# Altium project C40 IMB Upgrade.PrjPCB
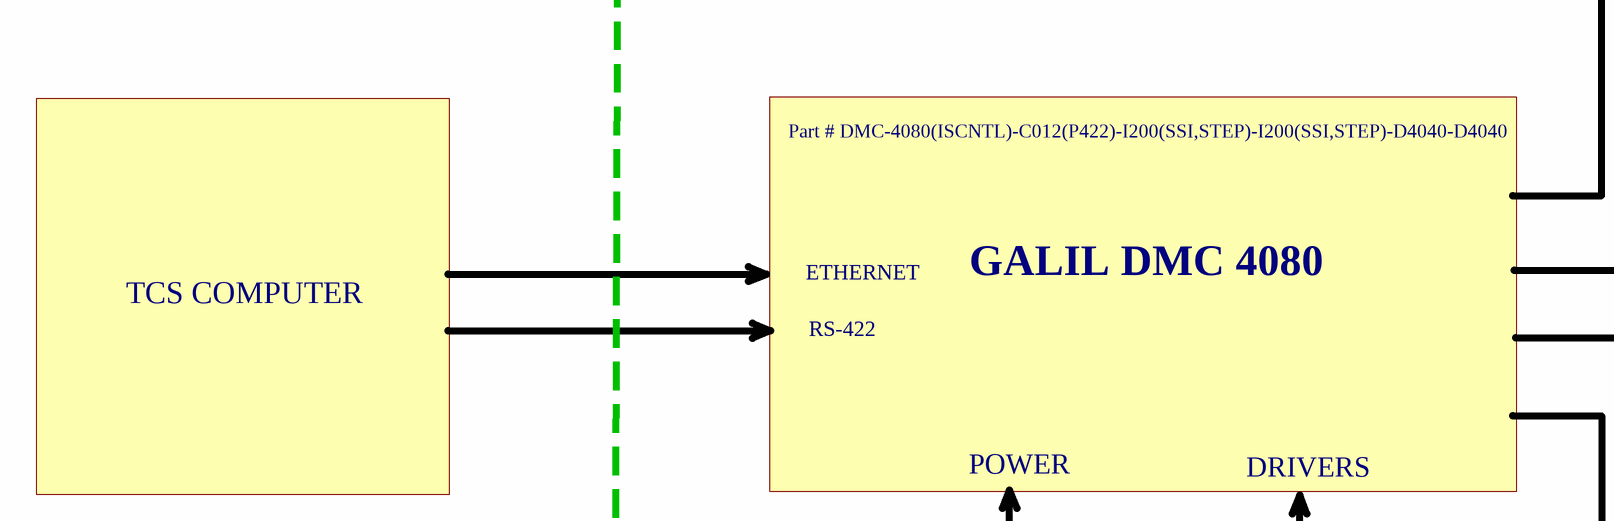
[diagram p0: C40_IMB_Block_Diagram.SchDoc, top left]
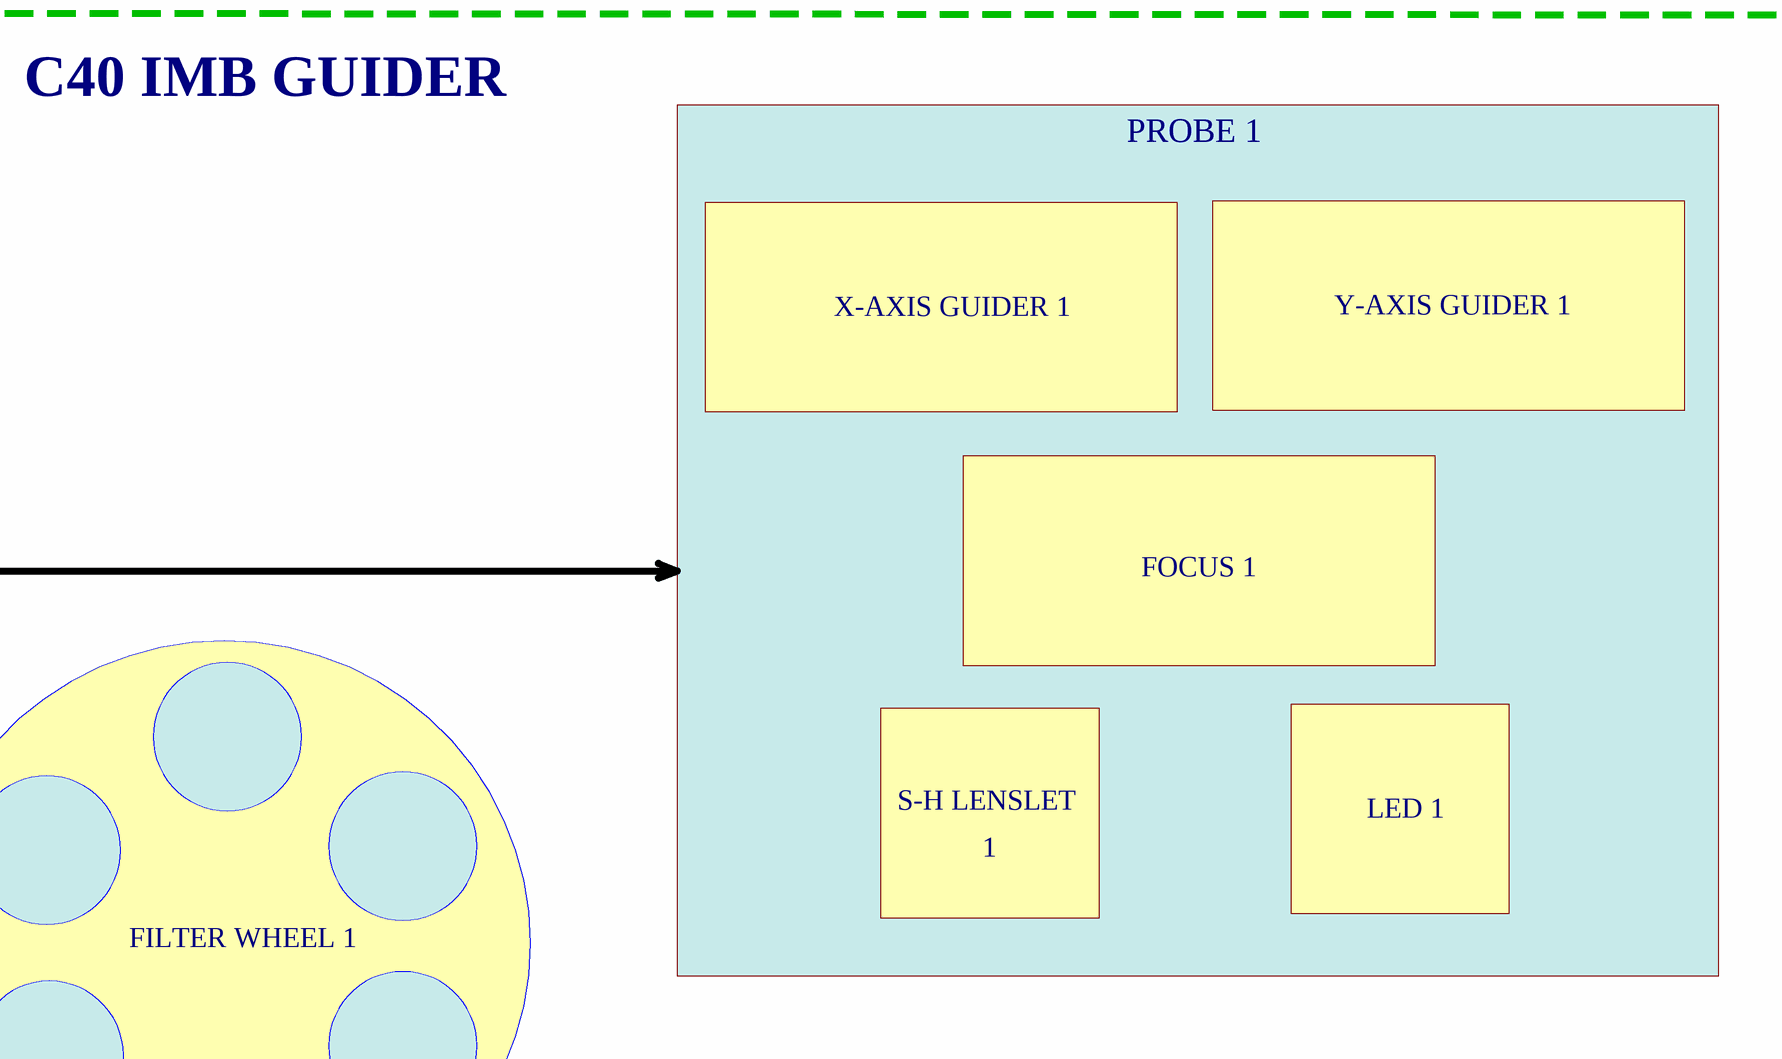
[diagram p1: C40_IMB_Block_Diagram.SchDoc, top right]
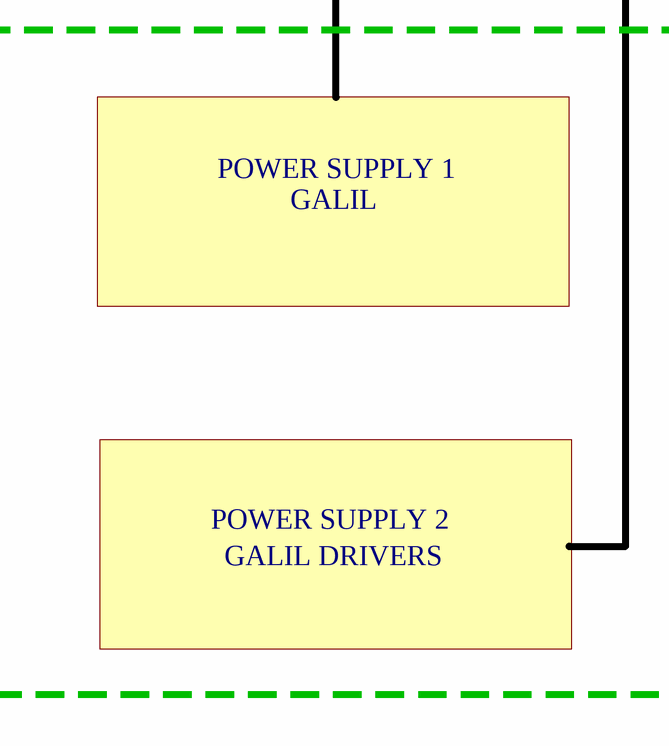
[diagram p2: C40_IMB_Block_Diagram.SchDoc, bottom left]
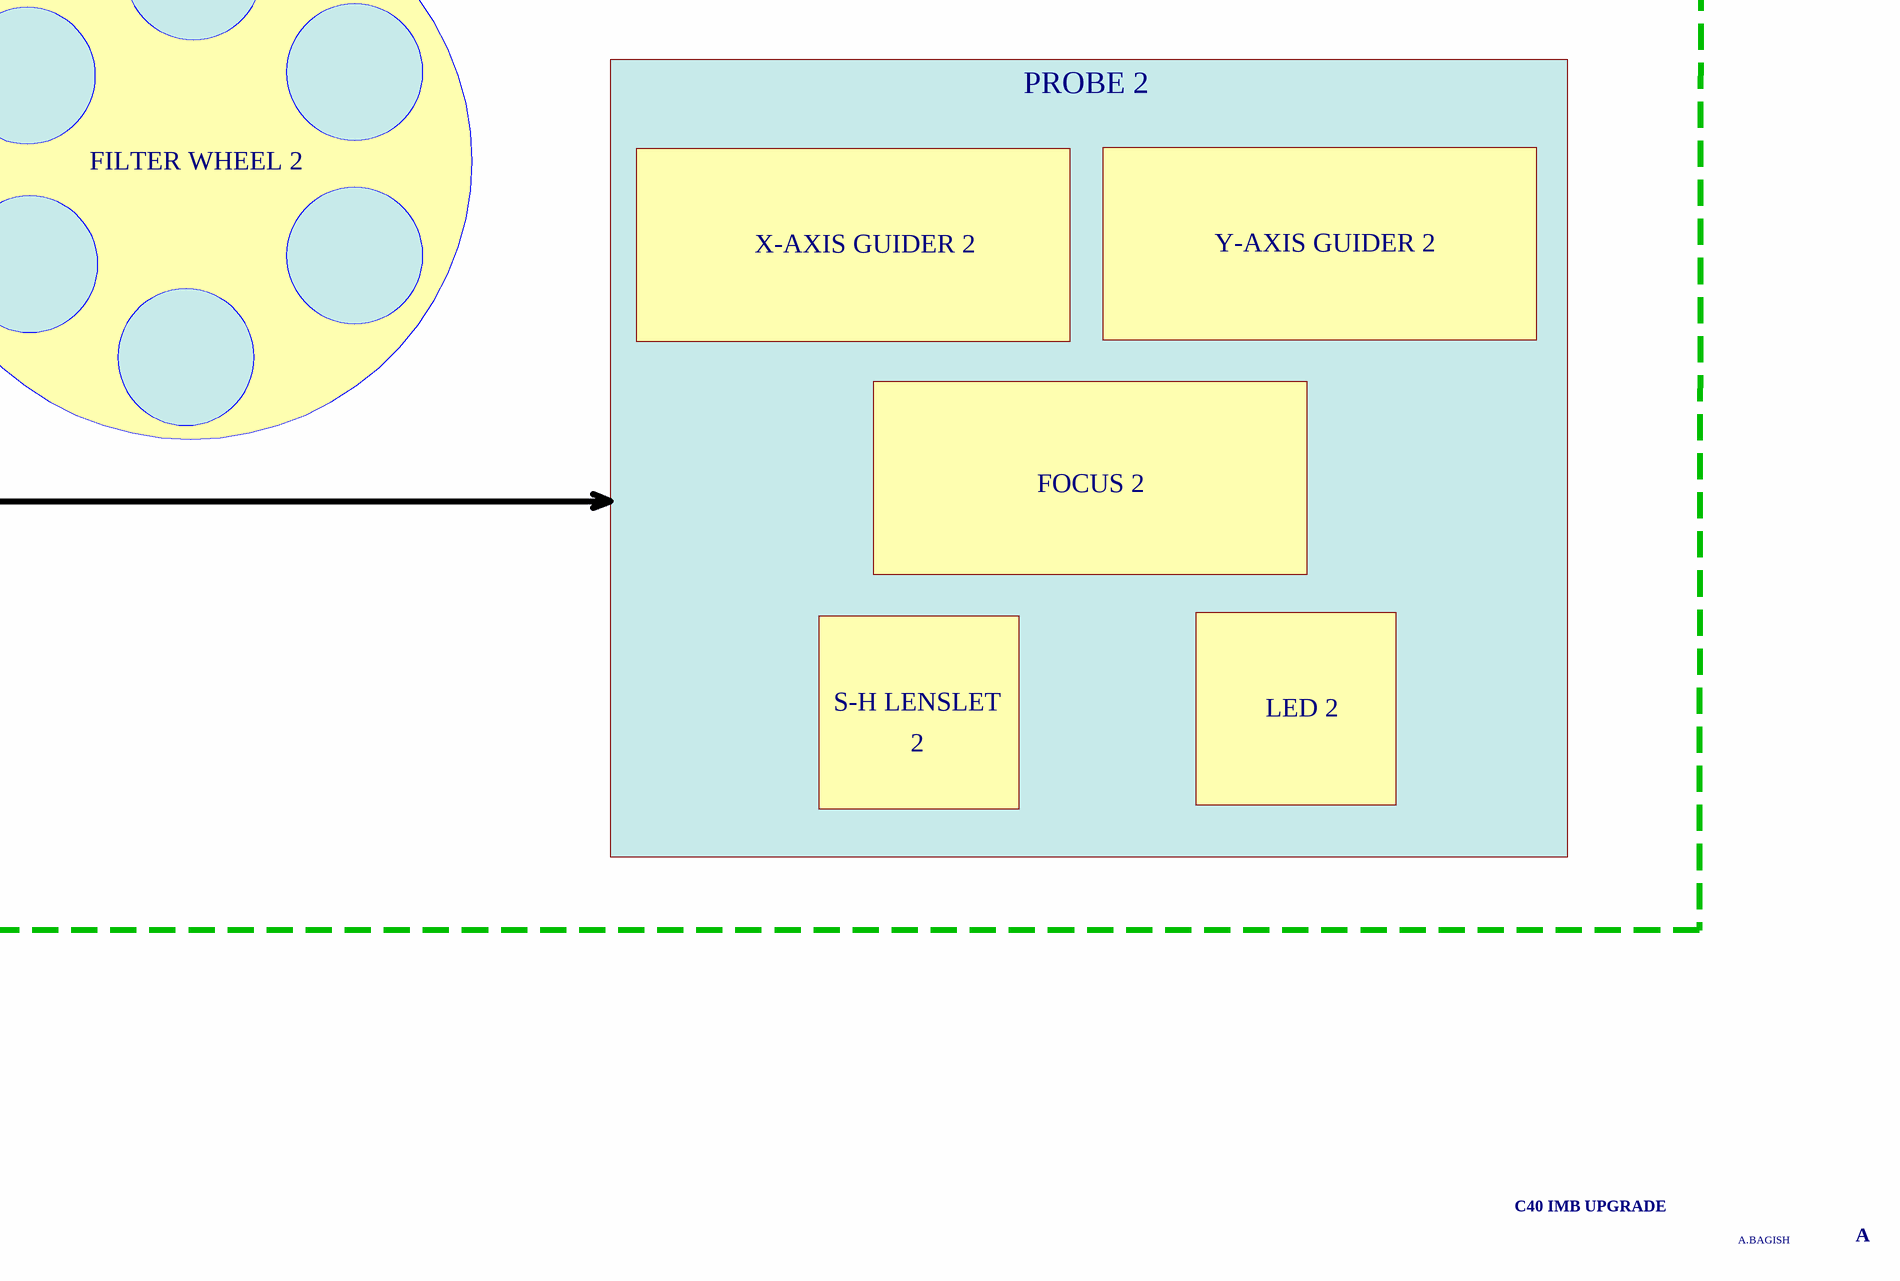
[diagram p3: C40_IMB_Block_Diagram.SchDoc, bottom right]
6 sheets, 221 parts. Net scope: flat (ports and power ports of the same name join across sheets).
Sheets:
  C40_IMB_Block_Diagram.SchDoc
  C40_IMB_Block_Diagram_2.SchDoc
  PROBE 1 CYLINDERS.SchDoc
  PROBE 2 CYLINDERS.SchDoc
  MOTORS ENCODERS.SchDoc
  C40 IMB POWER SUPPLY.SchDoc

## Sheet C40_IMB_Block_Diagram.SchDoc
size 812 x 571 mm; DocumentNumber: 2; SheetNumber: 1; SheetTotal: 7; PageSetup: Record=PageOptions|CenterHorizontal=True|CenterVertical=True|PrintScale=0.34|XCorrection=1.00|YCorrection=1.00|PrintKind=0|BorderSize=5000000|LeftOffset=0|BottomOffset=0|Orientation=2|PaperLength=1000|PaperWidth=1000|Scale=100|PaperSource=259|PrintQuality=600|MediaType=1|DitherType=10|PaperKind=11 x 17|PrintScaleMode=1

### Notes on the sheet
- C40 IMB GUIDER
- PROBE 1
- X-AXIS GUIDER 1
- Y-AXIS GUIDER 1
- FOCUS 1
- S-H LENSLET
- 1
- LED 1
- FILTER WHEEL 1
- Part # DMC-4080(ISCNTL)-C012(P422)-I200(SSI,STEP)-I200(SSI,STEP)-D4040-D4040
- TCS COMPUTER
- ETHERNET
- GALIL DMC 4080
- RS-422
- POWER
- DRIVERS
- PROBE 2
- FILTER WHEEL 2
- X-AXIS GUIDER 2
- Y-AXIS GUIDER 2
- POWER SUPPLY 1
- GALIL
- FOCUS 2
- LED 2
- POWER SUPPLY 2
- 2
- GALIL DRIVERS
- C40 IMB UPGRADE
- A.BAGISH
- A
- Carnegie Institution of Washington
- Pasadena, California 91101
- 813 Santa Barbara Street
- The Observatories
- PHONE (626) 577-1122               FAX (626) 795-8136
- Title:
- OCIW
- Size:
- Date:
- File:
- D
- Scale:
- Drawn By:
- Checked By:
- A. BAGISH
- alanb
- Revision:
- Sheet          of

## Sheet C40_IMB_Block_Diagram_2.SchDoc: C40 IMB BLOCK DIAGRAM 2
size 812 x 571 mm; DocumentNumber: 3; SheetNumber: 2; SheetTotal: 7; PageSetup: Record=PageOptions|CenterHorizontal=True|CenterVertical=True|PrintScale=0.48|XCorrection=1.00|YCorrection=1.00|PrintKind=0|BorderSize=5000000|LeftOffset=0|BottomOffset=0|Orientation=2|PaperLength=1000|PaperWidth=1000|Scale=100|PaperSource=15|PrintQuality=1200|MediaType=1|DitherType=10|PaperKind=11 x 17|PrintScaleMode=1
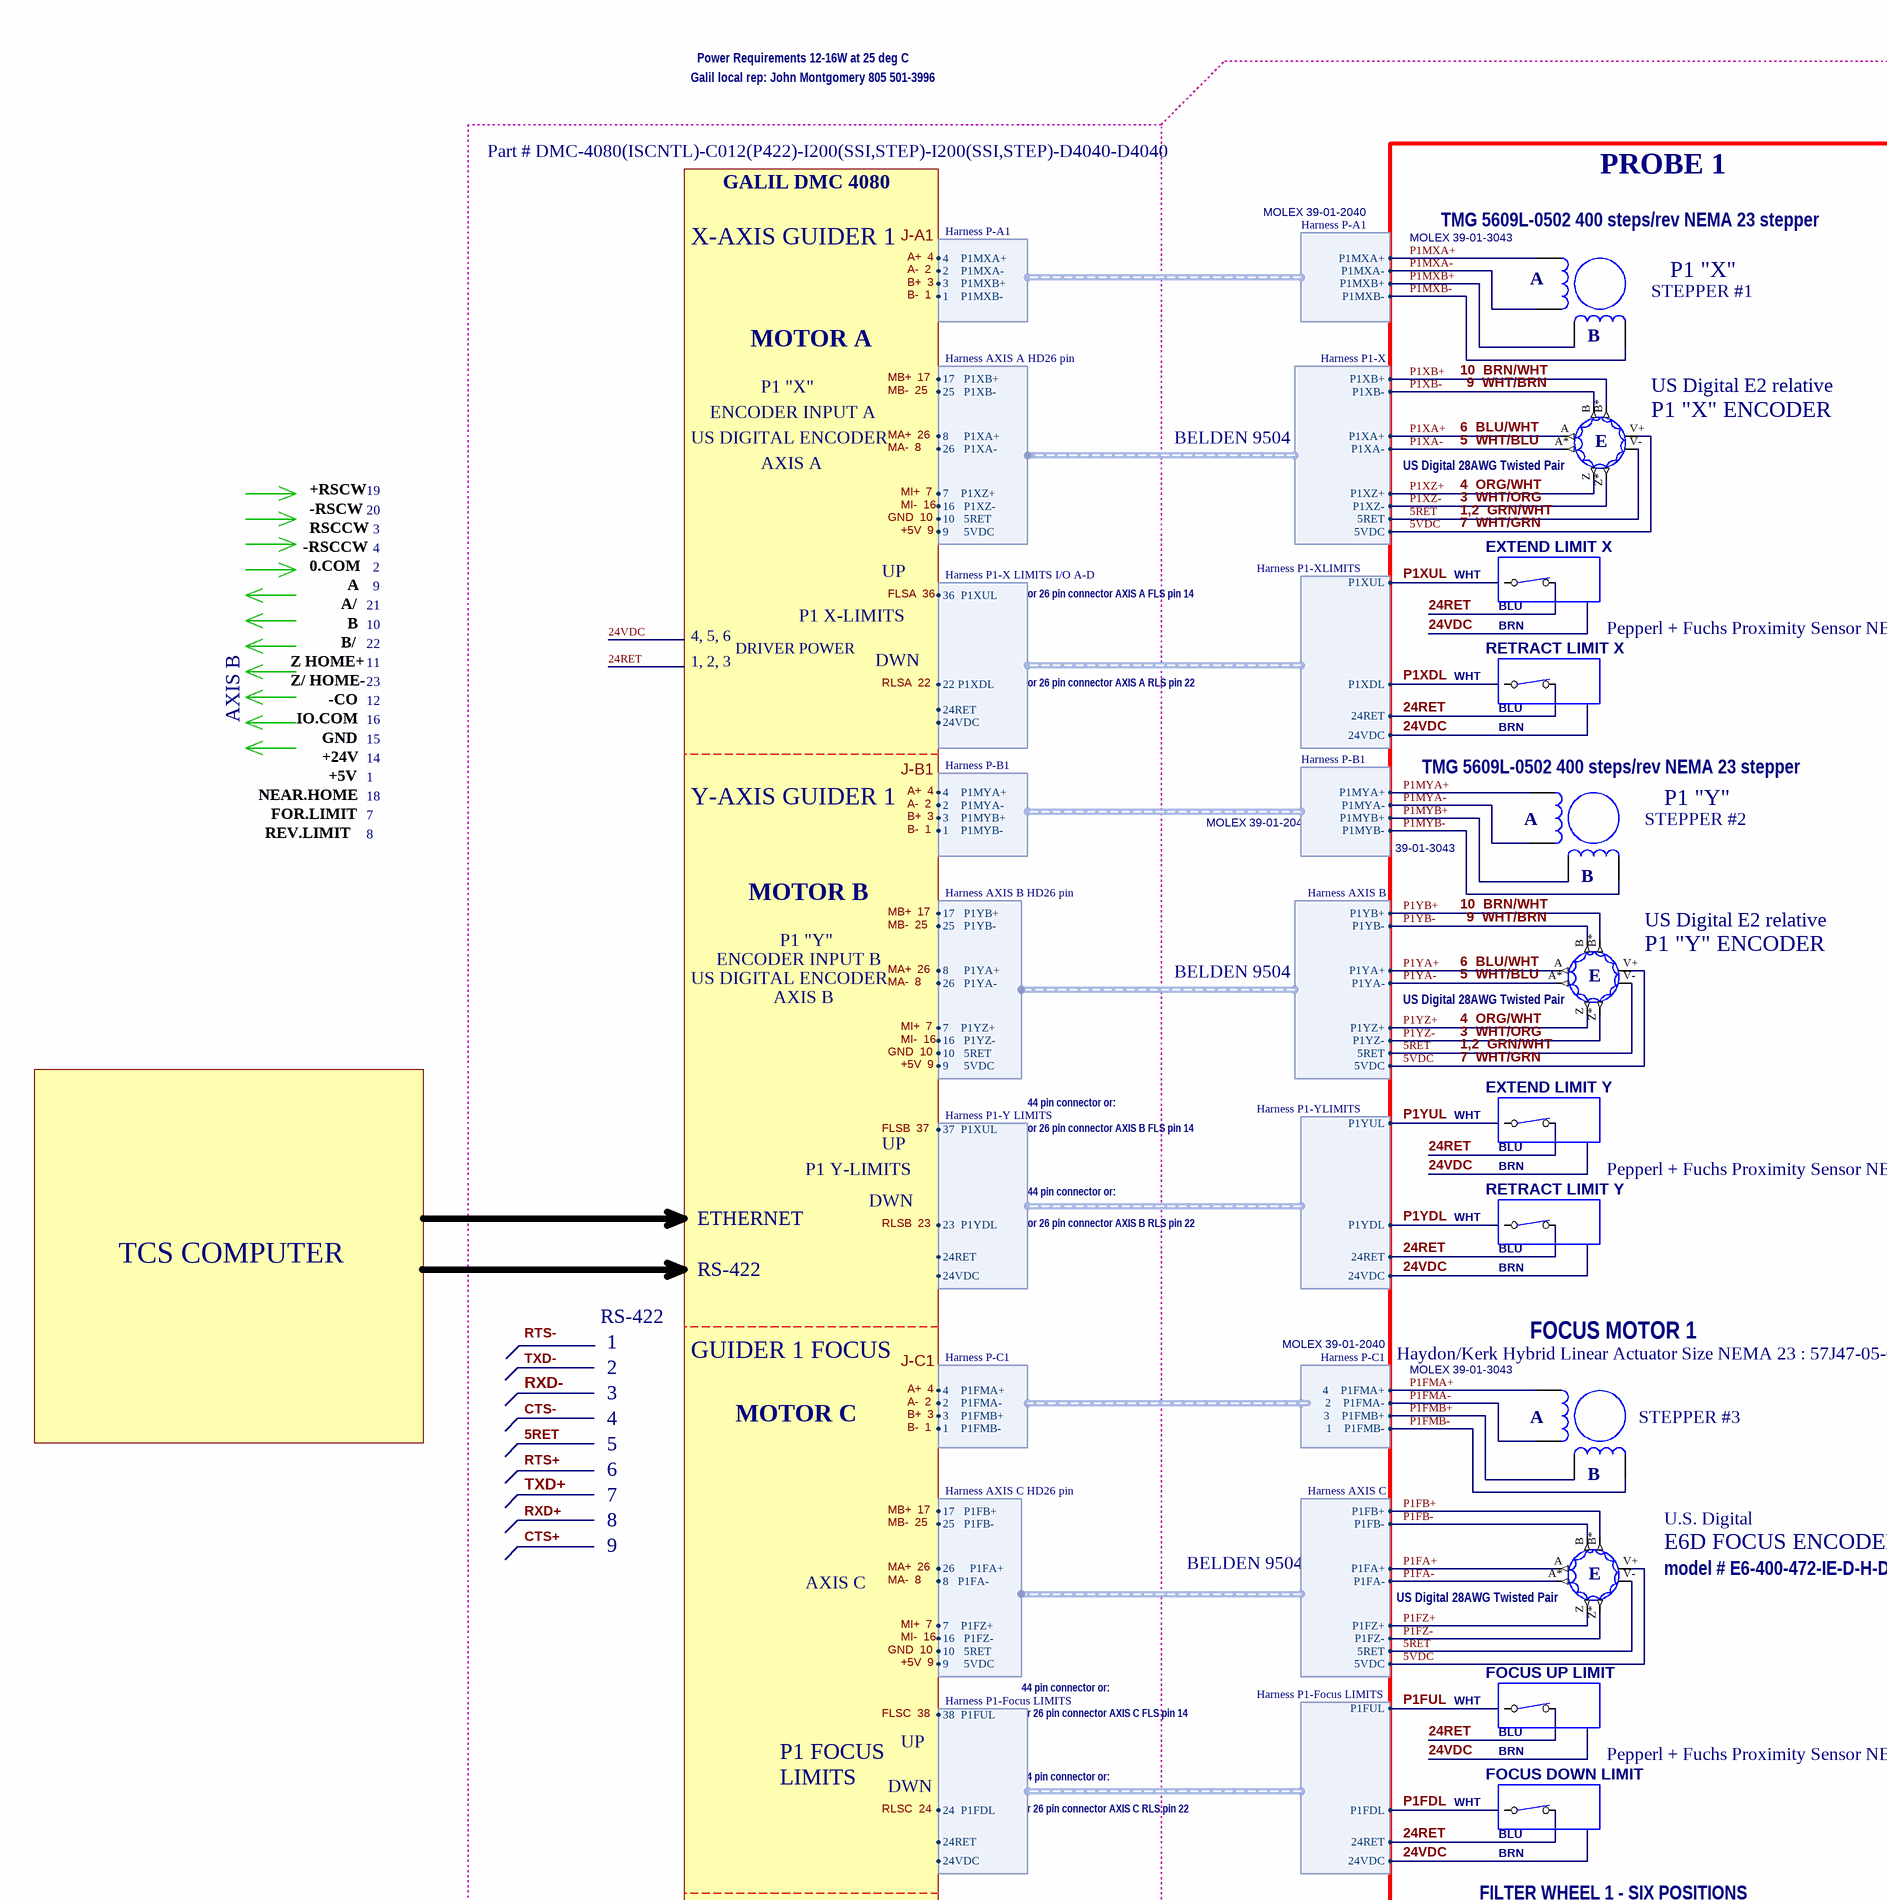
[diagram p4: C40_IMB_Block_Diagram_2.SchDoc, top left]
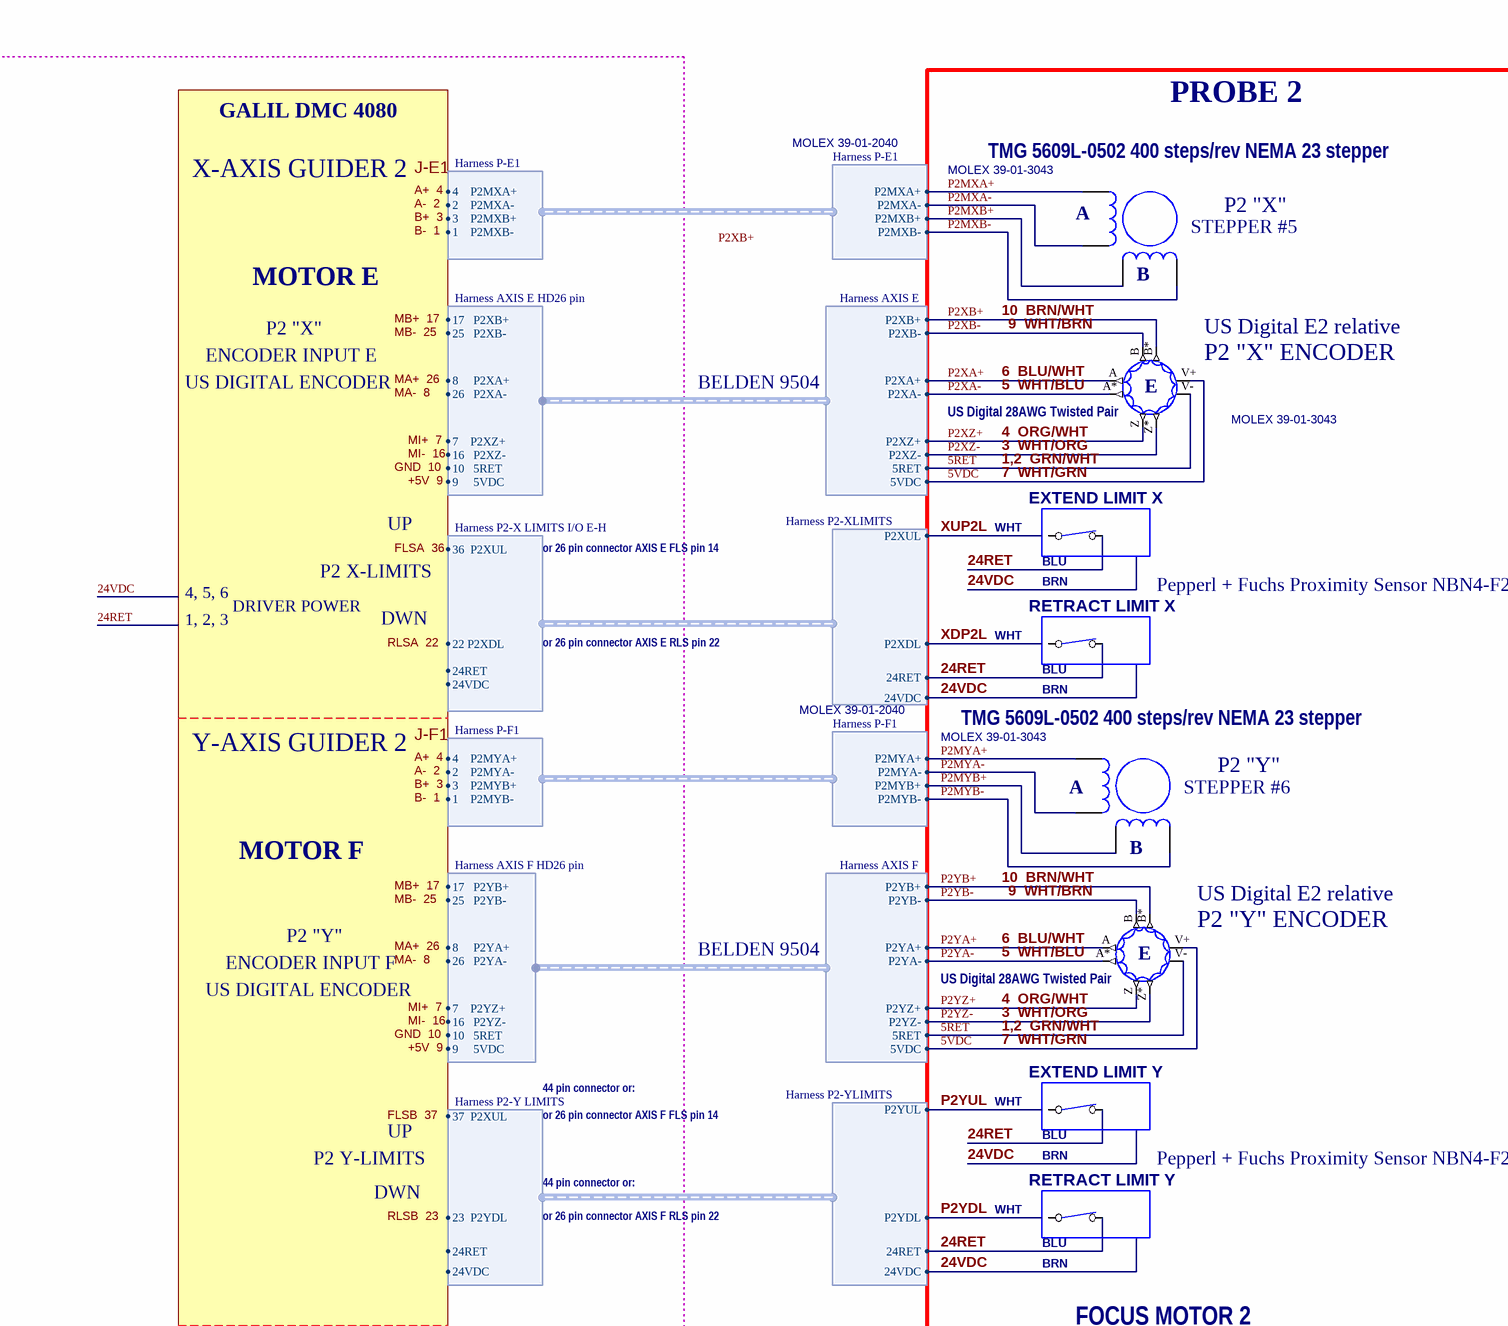
[diagram p5: C40_IMB_Block_Diagram_2.SchDoc, top middle]
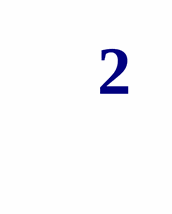
[diagram p6: C40_IMB_Block_Diagram_2.SchDoc, top right]
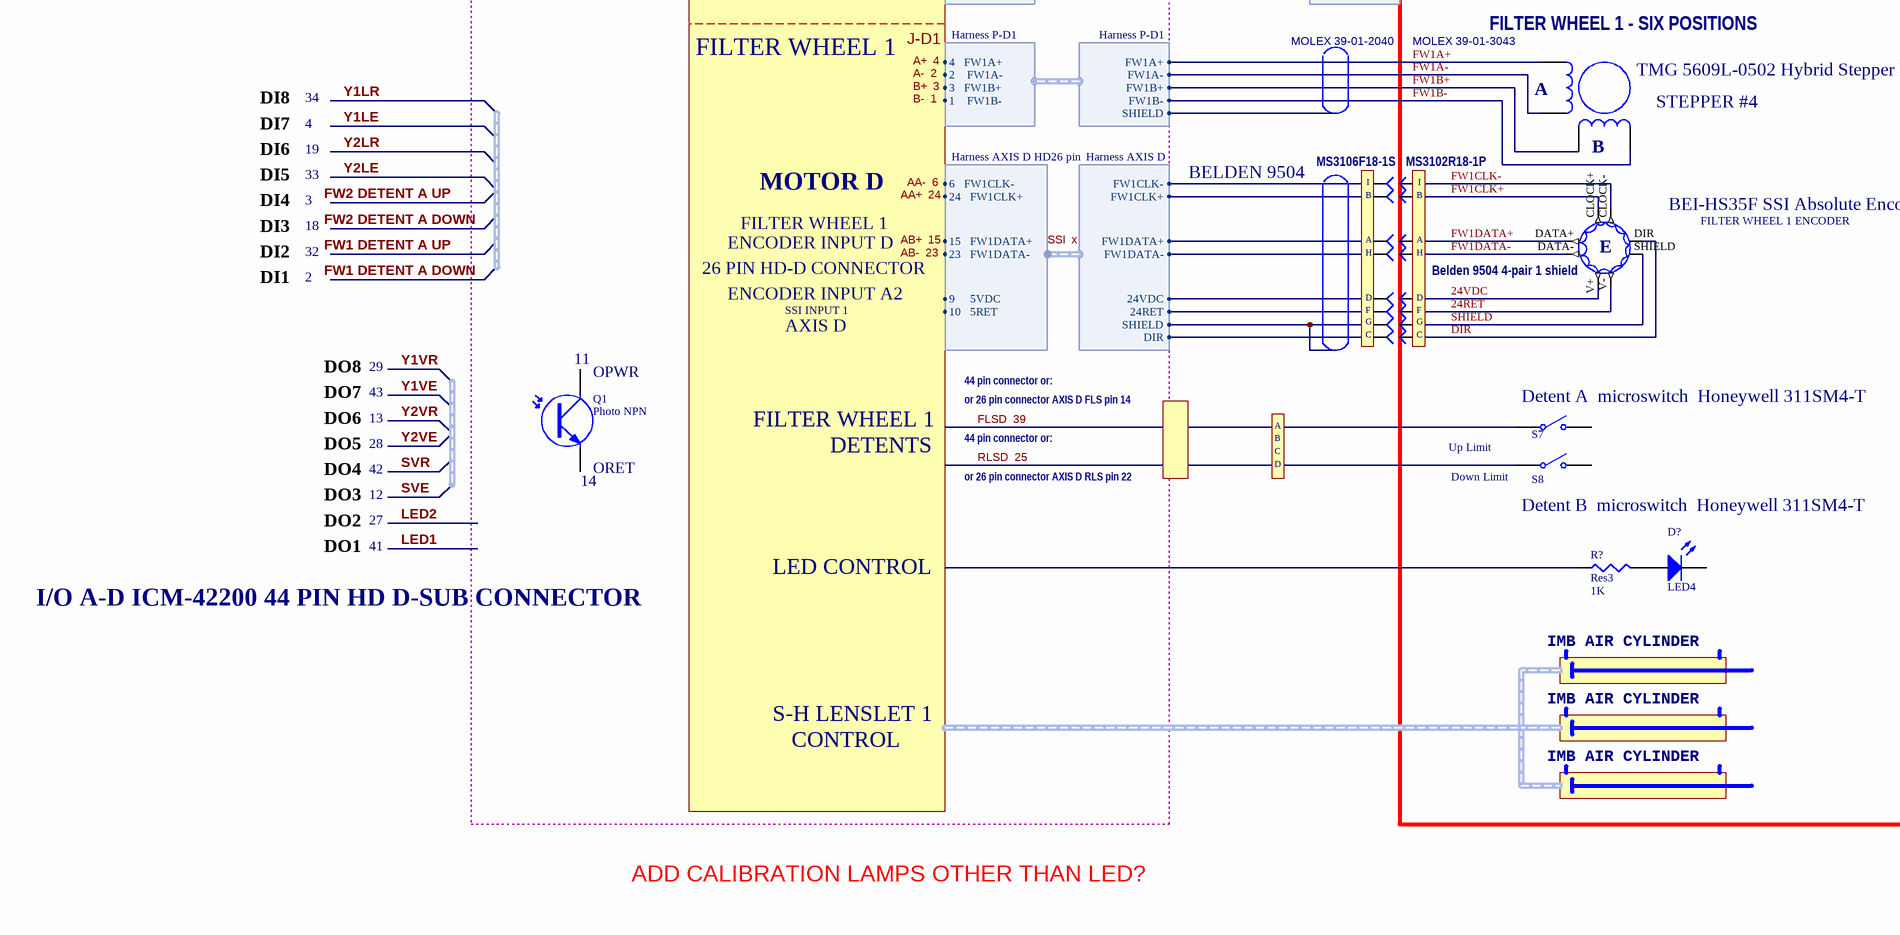
[diagram p7: C40_IMB_Block_Diagram_2.SchDoc, bottom left]
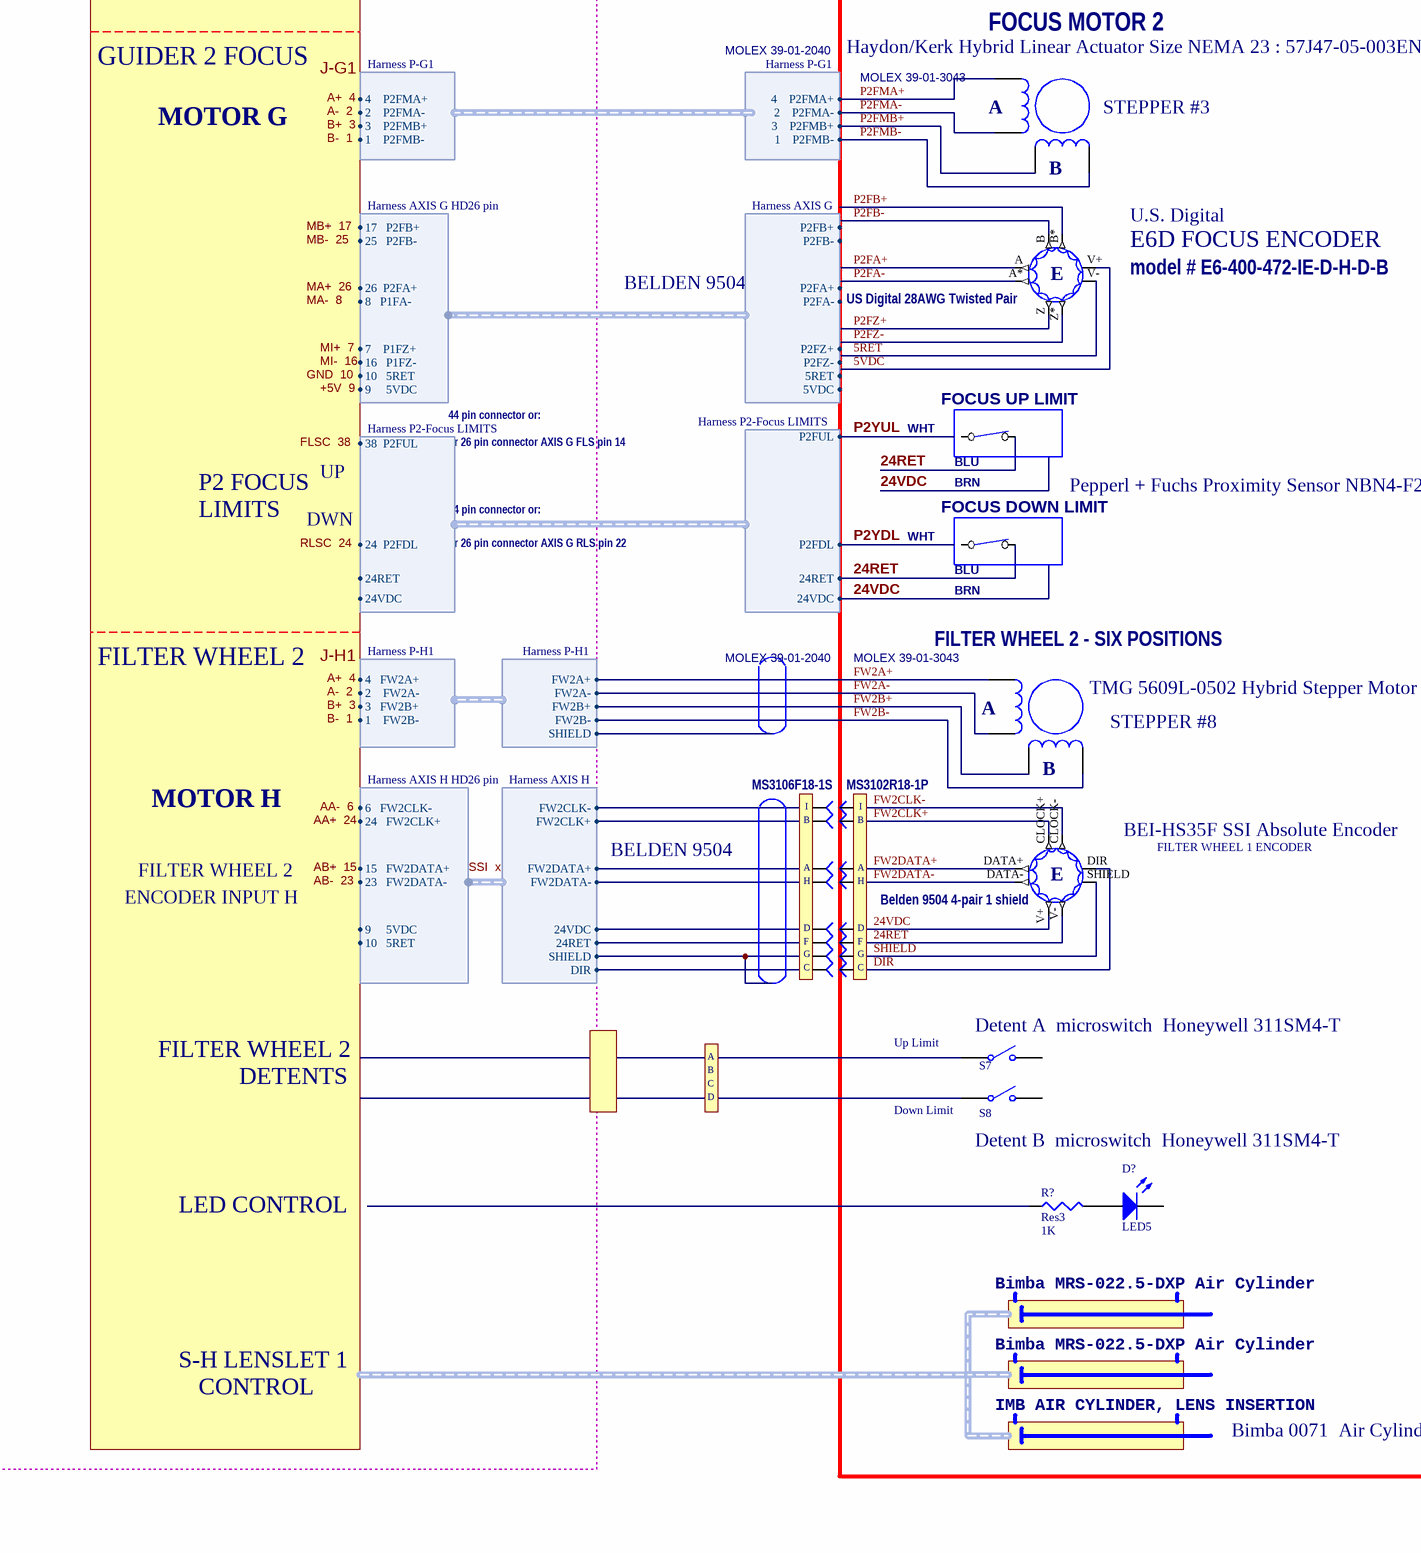
[diagram p8: C40_IMB_Block_Diagram_2.SchDoc, bottom middle]
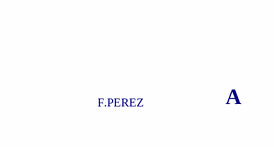
[diagram p9: C40_IMB_Block_Diagram_2.SchDoc, bottom right]

### Parts
(Parts that share a designator on the sheet are numbered #1, #2 ... from top to bottom, then left to right.)
?#1  SW-NC2  (value not drawn)
?#2  SW-NC2  (value not drawn)
?#3  SW-NC2  (value not drawn)
?#4  SW-NC2  (value not drawn)
?#5  SW-NC2  (value not drawn)
?#6  SW-NC2  (value not drawn)
?#7  SW-NC2  (value not drawn)
?#8  SW-NC2  (value not drawn)
?#9  SW-NC2  (value not drawn)
?#10  SW-NC2  (value not drawn)
?#11  SW-NC2  (value not drawn)
?#12  SW-NC2  (value not drawn)
?#13  (no value)
?#14  (no value)
?#15  (no value)
?#16  (no value)
?#17  (no value)
?#18  (no value)
?#19  (no value)
?#20  (no value)
?#21  (no value)
?#22  (no value)
?#23  (no value)
?#24  (no value)
?#25  (no value)
?#26  (no value)
?#27  (no value)
?#28  (no value)
B#1  (no value)
B#2  (no value)
B#3  (no value)
B#4  (no value)
B#5  (no value)
B#6  (no value)
B#7  (no value)
B#8  (no value)
B#9  (no value)
B#10  (no value)
B#11  (no value)
B#12  (no value)
B#13  (no value)
B#14  (no value)
B#15  (no value)
B#16  (no value)
BEI-HS35F_SSI_Absolute_Encoder#1  FILTER WHEEL 1 ENCODER
BEI-HS35F_SSI_Absolute_Encoder#2  FILTER WHEEL 1 ENCODER
Bimba_MRS-022.5-DXP_Air_Cylinder#1  (no value)
Bimba_MRS-022.5-DXP_Air_Cylinder#2  (no value)
D?#1  LED4  [LED-1]
D?#2  LED5  [LED-1]
Haydon/Kerk_Hybrid_Linear_Actuator_Size_NEMA_23_:_57J47-05-003ENG#1  STEPPER #3
Haydon/Kerk_Hybrid_Linear_Actuator_Size_NEMA_23_:_57J47-05-003ENG#2  STEPPER #3
IMB_AIR_CYLINDER#1  (no value)
IMB_AIR_CYLINDER#2  (no value)
IMB_AIR_CYLINDER#3  (no value)
IMB_AIR_CYLINDER,_LENS_INSERTION  (no value)
P1_"X"#1  STEPPER #1
P1_"Y"#1  STEPPER #2
P2_"X"  STEPPER #5
P2_"Y"  STEPPER #6
Q1  Photo NPN  [SFM-T2(3)/X1.6V]
R?#1  Res3  value 1K  [J1-0603]
R?#2  Res3  value 1K  [J1-0603]
S7#1  Up Limit  [SPST-2]
S7#2  Up Limit  [SPST-2]
S8#1  Down Limit  [SPST-2]
S8#2  Down Limit  [SPST-2]
TMG_5609L-0502_Hybrid_Stepper_Motor#1  STEPPER #4
TMG_5609L-0502_Hybrid_Stepper_Motor#2  STEPPER #8
U.S._Digital#1  E6D FOCUS ENCODER
U.S._Digital#2  E6D FOCUS ENCODER
US_Digital_E2_relative#1  P1 "X" ENCODER
US_Digital_E2_relative#2  P2 "X" ENCODER
US_Digital_E2_relative#3  P1 "Y" ENCODER
US_Digital_E2_relative#4  P2 "Y" ENCODER

### Blocks framed on the sheet
PROBE 1: ?#1 ?#3 ?#5 ?#7 ?#9 ?#11 B#1 B#3 B#5 B#7 B#9 B#11 B#13 B#15 BEI-HS35F_SSI_Absolute_Encoder#1 D?#1 Haydon/Kerk_Hybrid_Linear_Actuator_Size_NEMA_23_:_57J47-05-003ENG#2 IMB_AIR_CYLINDER#1-IMB_AIR_CYLINDER#3 P1_"X"#1 P1_"Y"#1 R?#1 S7#1 S8#1 TMG_5609L-0502_Hybrid_Stepper_Motor#1 U.S._Digital#2 US_Digital_E2_relative#1 US_Digital_E2_relative#3
PROBE 2: ?#2 ?#4 ?#6 ?#8 ?#10 ?#12 B#2 B#4 B#6 B#8 B#10 B#12 B#14 B#16 BEI-HS35F_SSI_Absolute_Encoder#2 Bimba_MRS-022.5-DXP_Air_Cylinder#1 Bimba_MRS-022.5-DXP_Air_Cylinder#2 D?#2 Haydon/Kerk_Hybrid_Linear_Actuator_Size_NEMA_23_:_57J47-05-003ENG#1 IMB_AIR_CYLINDER,_LENS_INSERTION P2_"X" P2_"Y" R?#2 S7#2 S8#2 TMG_5609L-0502_Hybrid_Stepper_Motor#2 U.S._Digital#1 US_Digital_E2_relative#2 US_Digital_E2_relative#4

### Harnesses
Harness P1-X: P1XB+, P1XB-, P1XA+, P1XA-, P1XZ+, P1XZ-, 5RET, 5VDC
Harness AXIS D: FW1CLK-, FW1CLK+, FW1DATA+, FW1DATA-, 24VDC, 24RET, SHIELD, DIR
Harness AXIS A HD26 pin: 17   P1XB+, 25   P1XB-, 8     P1XA+, 26   P1XA-, 7    P1XZ+, 16   P1XZ-, 10   5RET, 9     5VDC
Harness AXIS B: P1YB+, P1YB-, P1YA+, P1YA-, P1YZ+, P1YZ-, 5RET, 5VDC
Harness AXIS B HD26 pin: 17   P1YB+, 25   P1YB-, 8     P1YA+, 26   P1YA-, 7    P1YZ+, 16   P1YZ-, 10   5RET, 9     5VDC
Harness AXIS C: P1FB+, P1FB-, P1FA+, P1FA-, P1FZ+, P1FZ-, 5RET, 5VDC
Harness AXIS C HD26 pin: 17   P1FB+, 25   P1FB-, 26     P1FA+, 8   P1FA-, 7    P1FZ+, 16   P1FZ-, 10   5RET, 9     5VDC
Harness P1-XLIMITS: P1XUL, 24RET, 24VDC, P1XDL
Harness P1-X LIMITS I/O A-D: 36  P1XUL, 24RET, 24VDC, 22 P1XDL
Harness P1-YLIMITS: P1YUL, 24RET, 24VDC, P1YDL
Harness P1-Y LIMITS: 37  P1XUL, 24RET, 24VDC, 23  P1YDL
Harness P1-Focus LIMITS: P1FUL, 24RET, 24VDC, P1FDL
Harness P1-Focus LIMITS: 38  P1FUL, 24RET, 24VDC, 24  P1FDL
Harness AXIS D HD26 pin: 10   5RET, 9     5VDC, 6   FW1CLK-, 24   FW1CLK+, 15   FW1DATA+, 23   FW1DATA-
Harness P-C1: 4    P1FMA+, 2    P1FMA-, 3    P1FMB+, 1    P1FMB-
Harness P-B1: 4    P1MYA+, 2    P1MYA-, 3    P1MYB+, 1    P1MYB-
Harness P-B1: P1MYA+, P1MYA-, P1MYB+, P1MYB-
Harness P-A1: 4    P1MXA+, 2    P1MXA-, 3    P1MXB+, 1    P1MXB-
Harness P-A1: P1MXA+, P1MXA-, P1MXB+, P1MXB-
Harness P-D1: 4   FW1A+, 2    FW1A-, 3   FW1B+, 1    FW1B-
Harness P-D1: FW1A+, FW1A-, FW1B+, FW1B-, SHIELD
Harness AXIS E: P2XB+, P2XB-, P2XA+, P2XA-, P2XZ+, P2XZ-, 5RET, 5VDC
Harness AXIS E HD26 pin: 17   P2XB+, 25   P2XB-, 8     P2XA+, 26   P2XA-, 7    P2XZ+, 16   P2XZ-, 10   5RET, 9     5VDC
Harness AXIS F: P2YB+, P2YB-, P2YA+, P2YA-, P2YZ+, P2YZ-, 5RET, 5VDC
Harness AXIS F HD26 pin: 17   P2YB+, 25   P2YB-, 8     P2YA+, 26   P2YA-, 7    P2YZ+, 16   P2YZ-, 10   5RET, 9     5VDC
Harness AXIS G: P2FB+, P2FB-, P2FA+, P2FA-, P2FZ+, P2FZ-, 5RET, 5VDC
Harness AXIS G HD26 pin: 17   P2FB+, 25   P2FB-, 26  P2FA+, 8   P1FA-, 7    P1FZ+, 16   P1FZ-, 10   5RET, 9     5VDC
Harness P2-XLIMITS: P2XUL, 24RET, 24VDC, P2XDL
Harness P2-X LIMITS I/O E-H: 36  P2XUL, 24RET, 24VDC, 22 P2XDL
Harness P2-YLIMITS: P2YUL, 24RET, 24VDC, P2YDL
Harness P2-Y LIMITS: 37  P2XUL, 24RET, 24VDC, 23  P2YDL
Harness P2-Focus LIMITS: P2FUL, 24RET, 24VDC, P2FDL
Harness P2-Focus LIMITS: 38  P2FUL, 24RET, 24VDC, 24  P2FDL
Harness P-G1: 4    P2FMA+, 2    P2FMA-, 3    P2FMB+, 1    P2FMB-
Harness P-F1: 4    P2MYA+, 2    P2MYA-, 3    P2MYB+, 1    P2MYB-
Harness P-F1: P2MYA+, P2MYA-, P2MYB+, P2MYB-
Harness P-E1: 4    P2MXA+, 2    P2MXA-, 3    P2MXB+, 1    P2MXB-
Harness P-E1: P2MXA+, P2MXA-, P2MXB+, P2MXB-
Harness AXIS H: FW2CLK-, FW2CLK+, FW2DATA+, FW2DATA-, 24VDC, 24RET, SHIELD, DIR
Harness AXIS H HD26 pin: 10   5RET, 9     5VDC, 6   FW2CLK-, 24   FW2CLK+, 15   FW2DATA+, 23   FW2DATA-
Harness P-H1: 4   FW2A+, 2    FW2A-, 3   FW2B+, 1    FW2B-
Harness P-H1: FW2A+, FW2A-, FW2B+, FW2B-, SHIELD

### Nets
1,2  GRN/WHT: U.S._Digital#1.V- U.S._Digital#2.V- US_Digital_E2_relative#1.V- US_Digital_E2_relative#2.V- US_Digital_E2_relative#3.V- US_Digital_E2_relative#4.V- ; harness Harness P1-X.5RET, harness Harness AXIS B.5RET, harness Harness AXIS C.5RET, harness Harness AXIS E.5RET, harness Harness AXIS F.5RET  [also labelled 5RET]
3  WHT/ORG: US_Digital_E2_relative#1.Z* US_Digital_E2_relative#2.Z* US_Digital_E2_relative#3.Z* US_Digital_E2_relative#4.Z* ; harness Harness P1-X.P1XZ-, harness Harness AXIS B.P1YZ-, harness Harness AXIS E.P2XZ-, harness Harness AXIS F.P2YZ-  [also labelled P1XZ-, P1YZ-, P2XZ-, P2YZ-]
4  ORG/WHT: US_Digital_E2_relative#1.Z US_Digital_E2_relative#2.Z US_Digital_E2_relative#3.Z US_Digital_E2_relative#4.Z ; harness Harness P1-X.P1XZ+, harness Harness AXIS B.P1YZ+, harness Harness AXIS E.P2XZ+, harness Harness AXIS F.P2YZ+  [also labelled P1XZ+, P1YZ+, P2XZ+, P2YZ+]
5  WHT/BLU: US_Digital_E2_relative#1.A* US_Digital_E2_relative#2.A* US_Digital_E2_relative#3.A* US_Digital_E2_relative#4.A* ; harness Harness P1-X.P1XA-, harness Harness AXIS B.P1YA-, harness Harness AXIS E.P2XA-, harness Harness AXIS F.P2YA-  [also labelled P1XA-, P1YA-, P2XA-, P2YA-]
5VDC: U.S._Digital#1.V+ U.S._Digital#2.V+ US_Digital_E2_relative#1.V+ US_Digital_E2_relative#2.V+ US_Digital_E2_relative#3.V+ US_Digital_E2_relative#4.V+ ; harness Harness P1-X.5VDC, harness Harness AXIS B.5VDC, harness Harness AXIS C.5VDC, harness Harness AXIS E.5VDC, harness Harness AXIS F.5VDC  [also labelled 7  WHT/GRN]
6  BLU/WHT: US_Digital_E2_relative#1.A US_Digital_E2_relative#2.A US_Digital_E2_relative#3.A US_Digital_E2_relative#4.A ; harness Harness P1-X.P1XA+, harness Harness AXIS B.P1YA+, harness Harness AXIS E.P2XA+, harness Harness AXIS F.P2YA+  [also labelled P1XA+, P1YA+, P2XA+, P2YA+]
9  WHT/BRN: US_Digital_E2_relative#1.B US_Digital_E2_relative#2.B US_Digital_E2_relative#3.B US_Digital_E2_relative#4.B ; harness Harness P1-X.P1XB-, harness Harness AXIS B.P1YB-, harness Harness AXIS E.P2XB-, harness Harness AXIS F.P2YB-  [also labelled P1XB-, P1YB-, P2XB-, P2YB-]
10  BRN/WHT: US_Digital_E2_relative#1.B* US_Digital_E2_relative#2.B* US_Digital_E2_relative#3.B* US_Digital_E2_relative#4.B* ; harness Harness P1-X.P1XB+, harness Harness AXIS B.P1YB+, harness Harness AXIS E.P2XB+, harness Harness AXIS F.P2YB+  [also labelled P1XB+, P1YB+, P2XB+, P2YB+]
24RET: ?#1.2 ?#2.2 ?#3.2 ?#4.2 ?#5.2 ?#6.2 ?#7.2 ?#8.2 ?#9.2 ?#10.2 ?#11.2 ?#12.2 B#11.?1 B#12.?1 BEI-HS35F_SSI_Absolute_Encoder#1.V- BEI-HS35F_SSI_Absolute_Encoder#2.V- ; harness Harness P1-XLIMITS.24RET, harness Harness P1-X LIMITS I/O A-D.24RET, harness Harness P1-YLIMITS.24RET, harness Harness P1-Y LIMITS.24RET, harness Harness P1-Focus LIMITS.24RET, harness Harness P2-XLIMITS.24RET, harness Harness P2-X LIMITS I/O E-H.24RET, harness Harness P2-YLIMITS.24RET, harness Harness P2-Y LIMITS.24RET, harness Harness P2-Focus LIMITS.24RET
24VDC: B#9.?1 B#10.?1 BEI-HS35F_SSI_Absolute_Encoder#1.V+ BEI-HS35F_SSI_Absolute_Encoder#2.V+ ; harness Harness P1-XLIMITS.24VDC, harness Harness P1-X LIMITS I/O A-D.24VDC, harness Harness P1-YLIMITS.24VDC, harness Harness P1-Y LIMITS.24VDC, harness Harness P1-Focus LIMITS.24VDC, harness Harness P2-XLIMITS.24VDC, harness Harness P2-X LIMITS I/O E-H.24VDC, harness Harness P2-YLIMITS.24VDC, harness Harness P2-Y LIMITS.24VDC, harness Harness P2-Focus LIMITS.24VDC
DIR: B#15.?1 B#16.?1 BEI-HS35F_SSI_Absolute_Encoder#1.DIR BEI-HS35F_SSI_Absolute_Encoder#2.DIR
FLSD  39: S7#1.1(COMMON)
FW1A+: TMG_5609L-0502_Hybrid_Stepper_Motor#1.1 ; harness Harness P-D1.FW1A+
FW1A-: TMG_5609L-0502_Hybrid_Stepper_Motor#1.3 ; harness Harness P-D1.FW1A-
FW1B+: TMG_5609L-0502_Hybrid_Stepper_Motor#1.4 ; harness Harness P-D1.FW1B+
FW1B-: TMG_5609L-0502_Hybrid_Stepper_Motor#1.6 ; harness Harness P-D1.FW1B-
FW1CLK+: B#3.?1 BEI-HS35F_SSI_Absolute_Encoder#1.CLOCK+
FW1CLK-: BEI-HS35F_SSI_Absolute_Encoder#1.CLOCK-
FW1DATA+: B#5.?1 BEI-HS35F_SSI_Absolute_Encoder#1.DATA+
FW1DATA-: B#7.?1 BEI-HS35F_SSI_Absolute_Encoder#1.DATA-
FW2A+: TMG_5609L-0502_Hybrid_Stepper_Motor#2.1 ; harness Harness P-H1.FW2A+
FW2A-: TMG_5609L-0502_Hybrid_Stepper_Motor#2.3 ; harness Harness P-H1.FW2A-
FW2B+: TMG_5609L-0502_Hybrid_Stepper_Motor#2.4 ; harness Harness P-H1.FW2B+
FW2B-: TMG_5609L-0502_Hybrid_Stepper_Motor#2.6 ; harness Harness P-H1.FW2B-
FW2CLK+: B#4.?1 BEI-HS35F_SSI_Absolute_Encoder#2.CLOCK+
FW2CLK-: BEI-HS35F_SSI_Absolute_Encoder#2.CLOCK-
FW2DATA+: B#6.?1 BEI-HS35F_SSI_Absolute_Encoder#2.DATA+
FW2DATA-: B#8.?1 BEI-HS35F_SSI_Absolute_Encoder#2.DATA-
P1FA+: U.S._Digital#2.A ; harness Harness AXIS C.P1FA+
P1FA-: U.S._Digital#2.A* ; harness Harness AXIS C.P1FA-
P1FB+: U.S._Digital#2.B* ; harness Harness AXIS C.P1FB+
P1FB-: U.S._Digital#2.B ; harness Harness AXIS C.P1FB-
P1FDL: harness Harness P1-Focus LIMITS.P1FDL
P1FMA+: Haydon/Kerk_Hybrid_Linear_Actuator_Size_NEMA_23_:_57J47-05-003ENG#2.1 ; harness Harness P-C1.4    P1FMA+
P1FMA-: Haydon/Kerk_Hybrid_Linear_Actuator_Size_NEMA_23_:_57J47-05-003ENG#2.3 ; harness Harness P-C1.2    P1FMA-
P1FMB+: Haydon/Kerk_Hybrid_Linear_Actuator_Size_NEMA_23_:_57J47-05-003ENG#2.4 ; harness Harness P-C1.3    P1FMB+
P1FMB-: Haydon/Kerk_Hybrid_Linear_Actuator_Size_NEMA_23_:_57J47-05-003ENG#2.6 ; harness Harness P-C1.1    P1FMB-
P1FUL: harness Harness P1-Focus LIMITS.P1FUL
P1FZ+: U.S._Digital#2.Z ; harness Harness AXIS C.P1FZ+
P1FZ-: U.S._Digital#2.Z* ; harness Harness AXIS C.P1FZ-
P1MXA+: P1_"X"#1.1 ; harness Harness P-A1.P1MXA+
P1MXA-: P1_"X"#1.3 ; harness Harness P-A1.P1MXA-
P1MXB+: P1_"X"#1.4 ; harness Harness P-A1.P1MXB+
P1MXB-: P1_"X"#1.6 ; harness Harness P-A1.P1MXB-
P1MYA+: P1_"Y"#1.1 ; harness Harness P-B1.P1MYA+
P1MYA-: P1_"Y"#1.3 ; harness Harness P-B1.P1MYA-
P1MYB+: P1_"Y"#1.4 ; harness Harness P-B1.P1MYB+
P1MYB-: P1_"Y"#1.6 ; harness Harness P-B1.P1MYB-
P1XDL: harness Harness P1-XLIMITS.P1XDL
P1XUL: harness Harness P1-XLIMITS.P1XUL
P1YDL: harness Harness P1-YLIMITS.P1YDL
P1YUL: harness Harness P1-YLIMITS.P1YUL
P2FA+: U.S._Digital#1.A
P2FA-: U.S._Digital#1.A*
P2FB+: U.S._Digital#1.B*
P2FB-: U.S._Digital#1.B
P2FMA+: Haydon/Kerk_Hybrid_Linear_Actuator_Size_NEMA_23_:_57J47-05-003ENG#1.1 ; harness Harness P-G1.4    P2FMA+
P2FMA-: Haydon/Kerk_Hybrid_Linear_Actuator_Size_NEMA_23_:_57J47-05-003ENG#1.3 ; harness Harness P-G1.2    P2FMA-
P2FMB+: Haydon/Kerk_Hybrid_Linear_Actuator_Size_NEMA_23_:_57J47-05-003ENG#1.4 ; harness Harness P-G1.3    P2FMB+
P2FMB-: Haydon/Kerk_Hybrid_Linear_Actuator_Size_NEMA_23_:_57J47-05-003ENG#1.6 ; harness Harness P-G1.1    P2FMB-
P2FZ+: U.S._Digital#1.Z
P2FZ-: U.S._Digital#1.Z*
P2MXA+: P2_"X".1 ; harness Harness P-E1.P2MXA+
P2MXA-: P2_"X".3 ; harness Harness P-E1.P2MXA-
P2MXB+: P2_"X".4 ; harness Harness P-E1.P2MXB+
P2MXB-: P2_"X".6 ; harness Harness P-E1.P2MXB-
P2MYA+: P2_"Y".1 ; harness Harness P-F1.P2MYA+
P2MYA-: P2_"Y".3 ; harness Harness P-F1.P2MYA-
P2MYB+: P2_"Y".4 ; harness Harness P-F1.P2MYB+
P2MYB-: P2_"Y".6 ; harness Harness P-F1.P2MYB-
P2YDL: harness Harness P2-YLIMITS.P2YDL, harness Harness P2-Focus LIMITS.P2FDL
P2YUL: harness Harness P2-YLIMITS.P2YUL, harness Harness P2-Focus LIMITS.P2FUL
RLSD  25: S8#1.1(COMMON)
SHIELD: B#13.?1 B#14.?1 BEI-HS35F_SSI_Absolute_Encoder#1.SHIELD BEI-HS35F_SSI_Absolute_Encoder#2.SHIELD
XDP2L: harness Harness P2-XLIMITS.P2XDL
XUP2L: harness Harness P2-XLIMITS.P2XUL
NetD?#1_1: D?#1.1(A) R?#1.2
NetD?#2_1: D?#2.1(A) R?#2.2

Not connected (* = marked no-connect by the designer): ?#1 1; ?#2 1; ?#3 1; ?#4 1; ?#5 1; ?#6 1; ?#7 1; ?#8 1; ?#9 1; ?#10 1; ?#11 1; ?#12 1; ?#13 ?1; ?#14 ?1; ?#15 ?1; ?#16 ?1; ?#17 ?1; ?#18 ?1; ?#19 ?1; ?#20 ?1; ?#21 ?1; ?#22 ?1; ?#23 ?1; ?#24 ?1; ?#25 ?1; ?#26 ?1; ?#27 ?1; ?#28 ?1; B#1 ?1; B#2 ?1; D?#1 2(K); D?#2 2(K); Q1 1(C) 3(E); R?#1 1; R?#2 1; S7#1 2(NO); S7#2 1(COMMON) 2(NO); S8#1 2(NO); S8#2 1(COMMON) 2(NO)

### Notes on the sheet
- Power Requirements 12-16W at 25 deg C
- Full hardware handshaking required for Galil controller
- Galil local rep: John Montgomery 805 501-3996
- 2
- Part # DMC-4080(ISCNTL)-C012(P422)-I200(SSI,STEP)-I200(SSI,STEP)-D4040-D4040
- GALIL DMC 4080
- X-AXIS GUIDER 1
- MOLEX 39-01-2040
- MOLEX 39-01-3043
- (near P1_"X"#1) TMG 5609L-0502 400 steps/rev NEMA 23 stepper
- X-AXIS GUIDER 2
- (near P2_"X") TMG 5609L-0502 400 steps/rev NEMA 23 stepper
- (near P1_"X"#1) A
- (near P2_"X") A
- MOTOR A
- (near P1_"X"#1) B
- MOTOR E
- (near P2_"X") B
- US DIGITAL ENCODER
- ENCODER INPUT A
- P1 "X"
- BELDEN 9504
- ENCODER INPUT E
- P2 "X"
- +RSCW
- 19
- AXIS A
- (near US_Digital_E2_relative#1) US Digital 28AWG Twisted Pair
- (near US_Digital_E2_relative#2) US Digital 28AWG Twisted Pair
- -RSCCW
- 0.COM
- RSCCW
- -RSCW
- 20
- 3
- 4
- EXTEND LIMIT X
- A/
- B
- A
- 21
- 10
- 9
- P1 X-LIMITS
- UP
- or 26 pin connector AXIS A FLS pin 14
- WHT
- BLU
- BRN
- P2 X-LIMITS
- or 26 pin connector AXIS E FLS pin 14
- Z/ HOME-
- Z HOME+
- B/
- 22
- 23
- 11
- 1, 2, 3
- 4, 5, 6
- DRIVER POWER
- DWN
- or 26 pin connector AXIS A RLS pin 22
- RETRACT LIMIT X
- Pepperl + Fuchs Proximity Sensor NBN4-F29-A0
- or 26 pin connector AXIS E RLS pin 22
- AXIS B
- IO.COM
- GND
- -CO
- 12
- 16
- 15
- NEAR.HOME
- FOR.LIMIT
- +24V
- +5V
- 1
- 14
- 18
- 7
- Y-AXIS GUIDER 1
- (near P1_"Y"#1) TMG 5609L-0502 400 steps/rev NEMA 23 stepper
- (near P1_"Y"#1) A
- Y-AXIS GUIDER 2
- (near P2_"Y") TMG 5609L-0502 400 steps/rev NEMA 23 stepper
- (near P2_"Y") A
- REV.LIMIT
- 8
- (near P1_"Y"#1) B
- (near P2_"Y") B
- MOTOR B
- P1 "Y"
- MOTOR F
- ENCODER INPUT B
- (near US_Digital_E2_relative#3) US Digital 28AWG Twisted Pair
- ENCODER INPUT F
- P2 "Y"
- (near US_Digital_E2_relative#4) US Digital 28AWG Twisted Pair
- or 26 pin connector AXIS B FLS pin 14
- 44 pin connector or:
- EXTEND LIMIT Y
- or 26 pin connector AXIS F FLS pin 14
- P1 Y-LIMITS
- RETRACT LIMIT Y
- P2 Y-LIMITS
- TCS COMPUTER
- ETHERNET
- or 26 pin connector AXIS B RLS pin 22
- or 26 pin connector AXIS F RLS pin 22
- RS-422
- (near Haydon/Kerk_Hybrid_Linear_Actuator_Size_NEMA_23_:_57J47-05-003ENG#1) FOCUS MOTOR 2
- GUIDER 1 FOCUS
- (near Haydon/Kerk_Hybrid_Linear_Actuator_Size_NEMA_23_:_57J47-05-003ENG#2) FOCUS MOTOR 1
- GUIDER 2 FOCUS
- 5
- MOTOR C
- (near Haydon/Kerk_Hybrid_Linear_Actuator_Size_NEMA_23_:_57J47-05-003ENG#2) A
- MOTOR G
- (near Haydon/Kerk_Hybrid_Linear_Actuator_Size_NEMA_23_:_57J47-05-003ENG#1) A
- (near Haydon/Kerk_Hybrid_Linear_Actuator_Size_NEMA_23_:_57J47-05-003ENG#1) B
- 6
- (near Haydon/Kerk_Hybrid_Linear_Actuator_Size_NEMA_23_:_57J47-05-003ENG#2) B
- AXIS C
- (near U.S._Digital#2) model # E6-400-472-IE-D-H-D-B
- (near U.S._Digital#1) US Digital 28AWG Twisted Pair
- (near U.S._Digital#1) model # E6-400-472-IE-D-H-D-B
- (near U.S._Digital#2) US Digital 28AWG Twisted Pair
- or 26 pin connector AXIS C FLS pin 14
- FOCUS UP LIMIT
- or 26 pin connector AXIS G FLS pin 14
- P1 FOCUS
- P2 FOCUS
- LIMITS
- or 26 pin connector AXIS C RLS pin 22
- FOCUS DOWN LIMIT
- or 26 pin connector AXIS G RLS pin 22
- (near TMG_5609L-0502_Hybrid_Stepper_Motor#1) FILTER WHEEL 1 - SIX POSITIONS
- 34
- FILTER WHEEL 1
- (near TMG_5609L-0502_Hybrid_Stepper_Motor#1) A
- FILTER WHEEL 2
- (near TMG_5609L-0502_Hybrid_Stepper_Motor#2) FILTER WHEEL 2 - SIX POSITIONS
- (near TMG_5609L-0502_Hybrid_Stepper_Motor#2) A
- DI6
- DI7
- DI8
- (near TMG_5609L-0502_Hybrid_Stepper_Motor#1) B
- (near TMG_5609L-0502_Hybrid_Stepper_Motor#2) B
- DI4
- DI5
- 33
- MOTOR D
- (near B#1) MS3106F18-1S
- (near B#3) B
- (near B#1) I
- (near B#1) MS3102R18-1P
- MOTOR H
- (near B#2) MS3106F18-1S
- (near B#4) B
- (near B#2) I
- (near B#2) MS3102R18-1P
- DI1
- DI2
- DI3
- 32
- 26 PIN HD-D CONNECTOR
- ENCODER INPUT D
- (near B#5) A
- (near B#7) H
- (near BEI-HS35F_SSI_Absolute_Encoder#1) Belden 9504 4-pair 1 shield
- ENCODER INPUT H
- (near B#6) A
- (near B#8) H
- (near BEI-HS35F_SSI_Absolute_Encoder#2) Belden 9504 4-pair 1 shield
- ENCODER INPUT A2
- SSI INPUT 1
- AXIS D
- (near B#9) D
- (near B#15) C
- (near B#13) G
- (near B#11) F
- (near B#10) D
- (near B#16) C
- (near B#14) G
- (near B#12) F
- DO7
- DO8
- 43
- 29
- (near Q1) 11
- (near Q1) OPWR
- or 26 pin connector AXIS D FLS pin 14
- (near S7#1) Detent A  microswitch  Honeywell 311SM4-T
- (near S7#2) Detent A  microswitch  Honeywell 311SM4-T
- DO4
- DO5
- DO6
- 42
- 28
- 13
- (near Q1) 14
- (near Q1) ORET
- DETENTS
- or 26 pin connector AXIS D RLS pin 22
- D
- C
- DO2
- DO3
- 27
- (near S8#1) Detent B  microswitch  Honeywell 311SM4-T
- (near S8#2) Detent B  microswitch  Honeywell 311SM4-T
- I/O A-D ICM-42200 44 PIN HD D-SUB CONNECTOR
- DO1
- 41
- LED CONTROL
- S-H LENSLET 1
- CONTROL
- Bimba 0071  Air Cylinder
- ADD CALIBRATION LAMPS OTHER THAN LED?
- F.PEREZ
- Labels drawn without touching a wire or pin: +5V  9, A+  4, A-  2, AA+  24, AA-  6, AB+  15, AB-  23, B+  3, B-  1, CTS+, FLSA  36, FLSB  37, FLSC  38, FW1 DETENT A DOWN, FW1 DETENT A UP, FW2 DETENT A DOWN, FW2 DETENT A UP, GND  10, J-A1, J-B1, J-C1, J-D1, J-E1, J-F1, J-G1, J-H1, MA+  26, MA-  8, MB+  17, MB-  25, MI+  7, MI-  16, P2XB+, RLSA  22, RLSB  23, RLSC  24, RTS+, RTS-, SSI  x
- Carnegie Institution of Washington
- Pasadena, California 91101
- 813 Santa Barbara Street
- The Observatories
- PHONE (626) 577-1122               FAX (626) 795-8136
- Title:
- OCIW
- Size:
- Date:
- File:
- Scale:
- Drawn By:
- Checked By:
- A. BAGISH
- alanb
- Revision:
- Sheet          of
- (in symbol ENCODER DIF) E
- (in symbol ENCODER SSI) E

### Library data of the parts
?#13-?#28 = SOCKET-DMC
B#1-B#16 = PLUG-DMC
BEI-HS35F_SSI_Absolute_Encoder#1 BEI-HS35F_SSI_Absolute_Encoder#2 = ENCODER SSI
Bimba_MRS-022.5-DXP_Air_Cylinder#1 Bimba_MRS-022.5-DXP_Air_Cylinder#2 IMB_AIR_CYLINDER#1-IMB_AIR_CYLINDER#3 IMB_AIR_CYLINDER,_LENS_INSERTION = AIR CYL LONG IN
D?#1 D?#2 = LED1: Typical RED GaAs LED; Published: 8-Jun-2000; LatestRevisionDate: 08-Jul-2005; LatestRevisionNote: Mech Layer 1 removed.; PackageReference: LED-1; Publisher: Altium Limited; PackageDescription: LED; 2 Leads
Haydon/Kerk_Hybrid_Linear_Actuator_Size_NEMA_23_:_57J47-05-003ENG#1 Haydon/Kerk_Hybrid_Linear_Actuator_Size_NEMA_23_:_57J47-05-003ENG#2 P1_"X"#1 P1_"Y"#1 P2_"X" P2_"Y" TMG_5609L-0502_Hybrid_Stepper_Motor#1 TMG_5609L-0502_Hybrid_Stepper_Motor#2 = MOTOR STEPPER
Q1 = Photo NPN: NPN Phototransistor; Published: 24-Mar-1999; LatestRevisionDate: 17-Jul-2002; LatestRevisionNote: Re-released for DXP Platform.; PackageReference: TO-220_A; Publisher: Altium Limited; Code_JEDEC: TO-220-AC
R?#1 R?#2 = Res3: Resistor; Published: 8-Jun-2000; LatestRevisionDate: 29-May-2009; LatestRevisionNote: IPC-7351 Footprint Added.; PackageReference: J1-0603; Publisher: Altium Limited; PackageDescription: Chip Resistor
S7#1 S7#2 S8#1 S8#2 = SW-SPST: Single-Pole, Single-Throw Switch; Published: 24-Mar-1999; LatestRevisionDate: 17-Jul-2002; LatestRevisionNote: Re-released for DXP Platform.; Publisher: Altium Limited
U.S._Digital#1 U.S._Digital#2 US_Digital_E2_relative#1-US_Digital_E2_relative#4 = ENCODER DIF

## Sheet PROBE 1 CYLINDERS.SchDoc: PROBE 1 CYLINDERS
size 558 x 401 mm; Organization: Carnegie Institution of Washington; DocumentNumber: 4; SheetNumber: 3; SheetTotal: 7; PageSetup: Record=PageOptions|CenterHorizontal=True|CenterVertical=True|PrintScale=0.68|XCorrection=1.00|YCorrection=1.00|PrintKind=0|BorderSize=5000000|LeftOffset=0|BottomOffset=0|Orientation=2|PaperLength=1000|PaperWidth=1000|Scale=100|PaperSource=15|PrintQuality=1200|MediaType=1|DitherType=10|PaperKind=11 x 17|PrintScaleMode=1; DocumentName: CYLINDERS
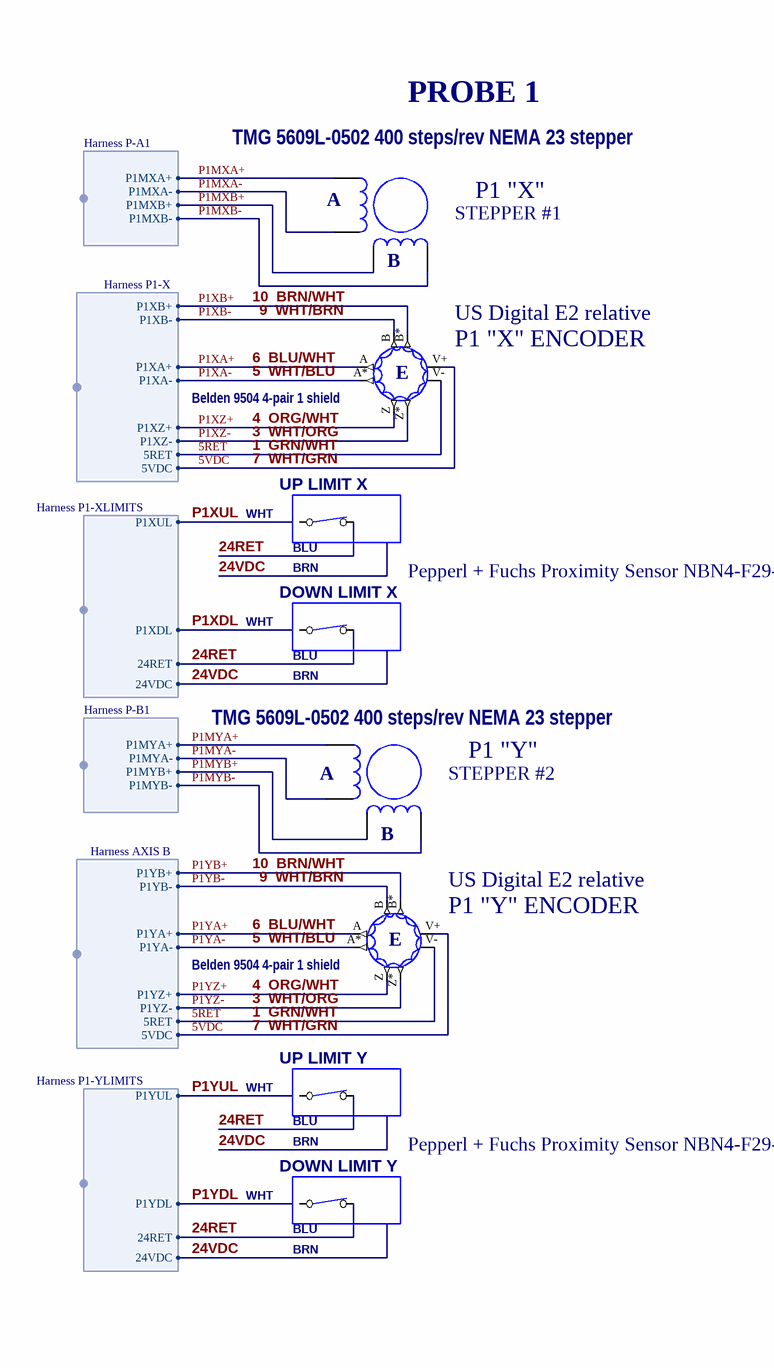
[diagram p10: PROBE 1 CYLINDERS.SchDoc, left]
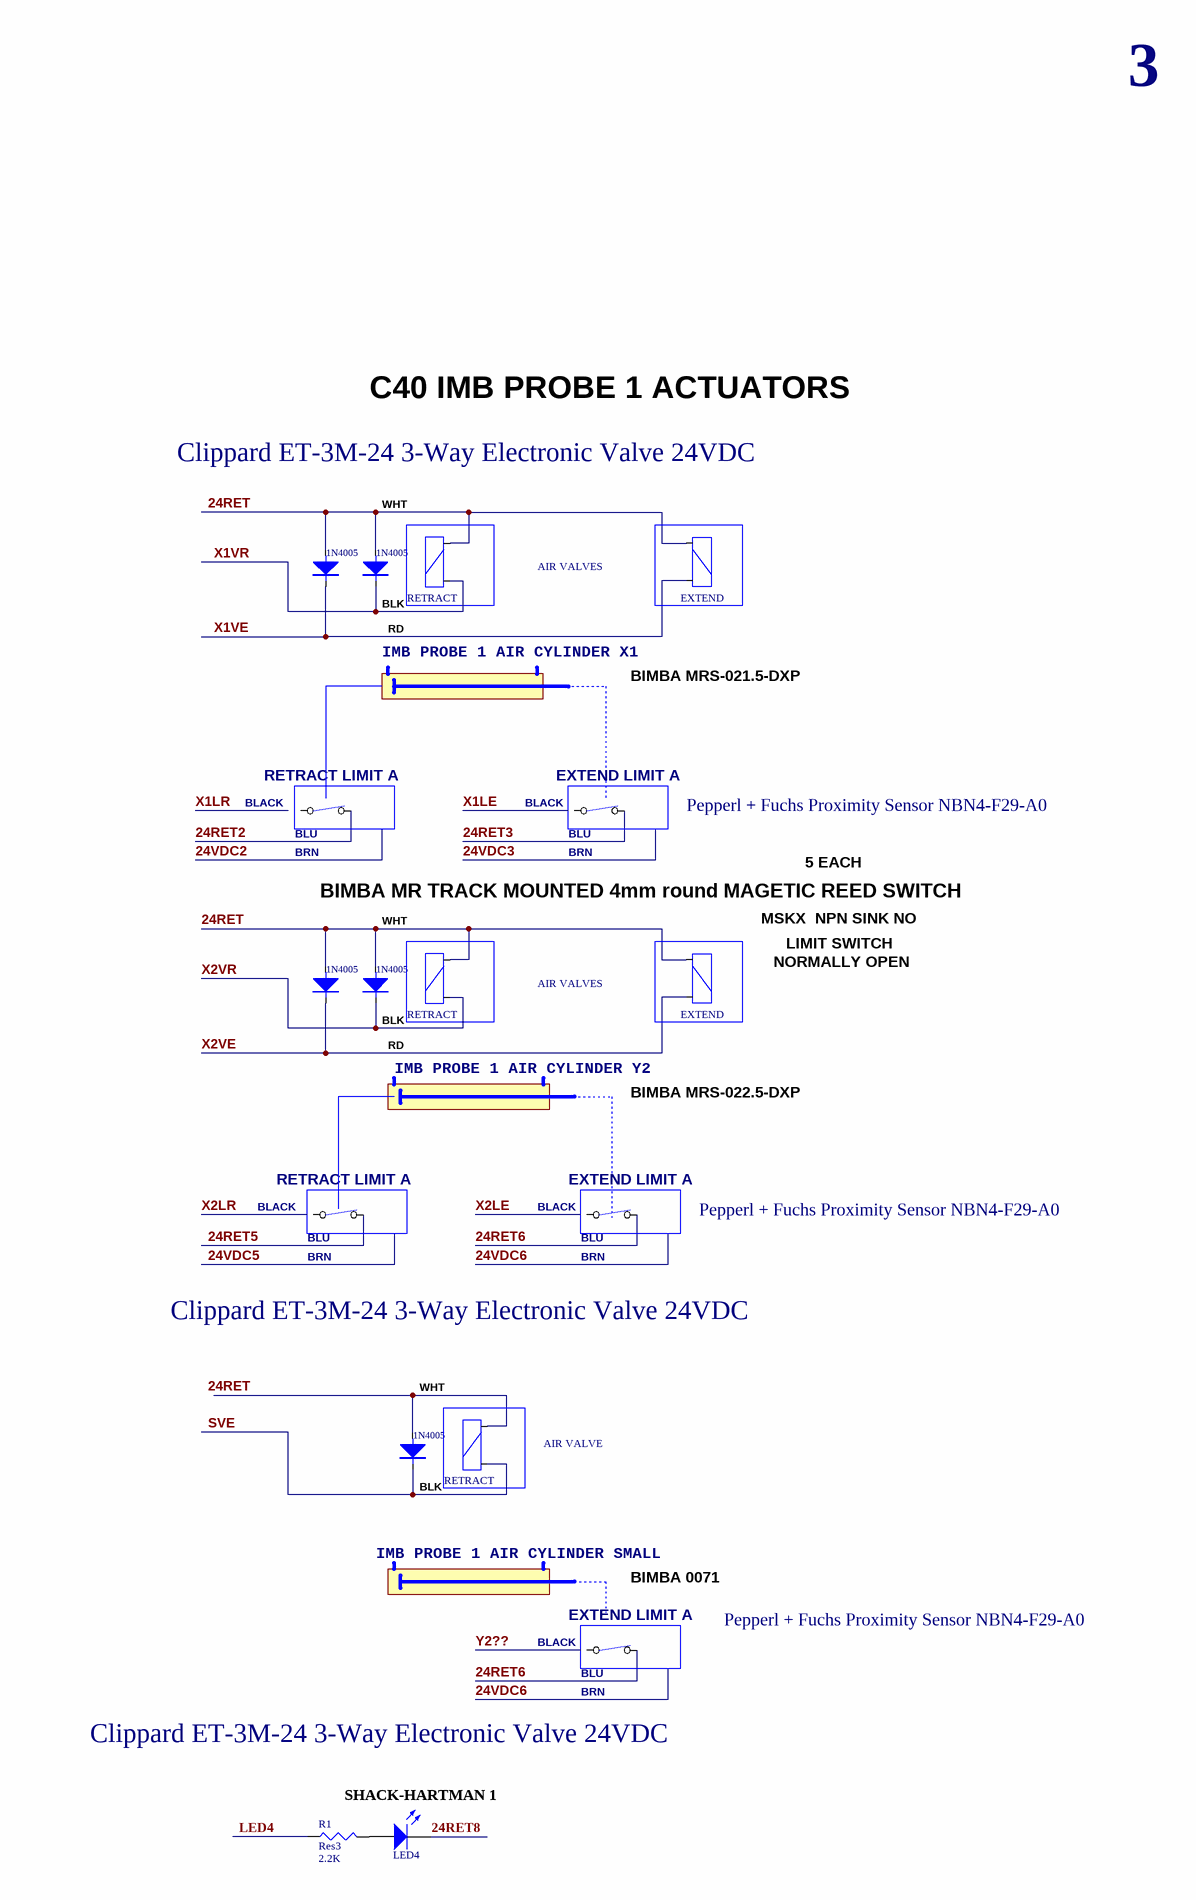
[diagram p11: PROBE 1 CYLINDERS.SchDoc, right]

### Parts
(Parts that share a designator on the sheet are numbered #1, #2 ... from top to bottom, then left to right.)
?#29  RETRACT
?#30  1N4005
?#31  1N4005
?#32  SW-NC2  (value not drawn)
?#33  SW-NC2  (value not drawn)
?#34  SW-NC2  (value not drawn)
?#35  SW-NC2  (value not drawn)
?#36  RETRACT
?#37  1N4005
?#38  1N4005
?#39  SW-NC2  (value not drawn)
?#40  SW-NC2  (value not drawn)
?#41  SW-NC2  (value not drawn)
?#42  RETRACT  S: AIR VALVE
?#43  1N4005
?#44  SW-NC2  (value not drawn)
?#45  SW-NC2  (value not drawn)
AIR_VALVES#1  EXTEND
AIR_VALVES#2  EXTEND
D?#3  LED4  [LED-0]
IMB_PROBE_1_AIR_CYLINDER_SMALL#1  (no value)
IMB_PROBE_1_AIR_CYLINDER_X1  (no value)
IMB_PROBE_1_AIR_CYLINDER_Y2  (no value)
P1_"X"#2  STEPPER #1
P1_"Y"#2  STEPPER #2
R1#1  Res3  value 2.2K  [J1-0603]
US_Digital_E2_relative#5  P1 "X" ENCODER
US_Digital_E2_relative#6  P1 "Y" ENCODER

### Harnesses
Harness P1-X: P1XB+, P1XB-, P1XA+, P1XA-, P1XZ+, P1XZ-, 5RET, 5VDC
Harness AXIS B: P1YB+, P1YB-, P1YA+, P1YA-, P1YZ+, P1YZ-, 5RET, 5VDC
Harness P1-XLIMITS: P1XUL, 24RET, 24VDC, P1XDL
Harness P1-YLIMITS: P1YUL, 24RET, 24VDC, P1YDL
Harness P-B1: P1MYA+, P1MYA-, P1MYB+, P1MYB-
Harness P-A1: P1MXA+, P1MXA-, P1MXB+, P1MXB-

### Nets
1  GRN/WHT: US_Digital_E2_relative#5.V- US_Digital_E2_relative#6.V- ; harness Harness P1-X.5RET, harness Harness AXIS B.5RET  [also labelled 5RET]
3  WHT/ORG: US_Digital_E2_relative#5.Z* US_Digital_E2_relative#6.Z* ; harness Harness P1-X.P1XZ-, harness Harness AXIS B.P1YZ-  [also labelled P1XZ-, P1YZ-]
4  ORG/WHT: US_Digital_E2_relative#5.Z US_Digital_E2_relative#6.Z ; harness Harness P1-X.P1XZ+, harness Harness AXIS B.P1YZ+  [also labelled P1XZ+, P1YZ+]
5  WHT/BLU: US_Digital_E2_relative#5.A* US_Digital_E2_relative#6.A* ; harness Harness P1-X.P1XA-, harness Harness AXIS B.P1YA-  [also labelled P1XA-, P1YA-]
5VDC: US_Digital_E2_relative#5.V+ US_Digital_E2_relative#6.V+ ; harness Harness P1-X.5VDC, harness Harness AXIS B.5VDC  [also labelled 7  WHT/GRN]
6  BLU/WHT: US_Digital_E2_relative#5.A US_Digital_E2_relative#6.A ; harness Harness P1-X.P1XA+, harness Harness AXIS B.P1YA+  [also labelled P1XA+, P1YA+]
9  WHT/BRN: US_Digital_E2_relative#5.B US_Digital_E2_relative#6.B ; harness Harness P1-X.P1XB-, harness Harness AXIS B.P1YB-  [also labelled P1XB-, P1YB-]
10  BRN/WHT: US_Digital_E2_relative#5.B* US_Digital_E2_relative#6.B* ; harness Harness P1-X.P1XB+, harness Harness AXIS B.P1YB+  [also labelled P1XB+, P1YB+]
24RET: ?#29.10(-) ?#30.1(A) ?#31.1(A) ?#34.2 ?#35.2 ?#36.10(-) ?#37.1(A) ?#38.1(A) ?#41.2 ?#44.2 AIR_VALVES#1.10(-) AIR_VALVES#2.10(-) ; harness Harness P1-XLIMITS.24RET, harness Harness P1-YLIMITS.24RET
24RET2: ?#32.2
24RET3: ?#33.2
24RET5: ?#39.2
24RET6: ?#40.2 ?#45.2
24RET8: D?#3.2(K)
24VDC: harness Harness P1-XLIMITS.24VDC, harness Harness P1-YLIMITS.24VDC
LED4: R1#1.1
P1MXA+: P1_"X"#2.1 ; harness Harness P-A1.P1MXA+
P1MXA-: P1_"X"#2.3 ; harness Harness P-A1.P1MXA-
P1MXB+: P1_"X"#2.4 ; harness Harness P-A1.P1MXB+
P1MXB-: P1_"X"#2.6 ; harness Harness P-A1.P1MXB-
P1MYA+: P1_"Y"#2.1 ; harness Harness P-B1.P1MYA+
P1MYA-: P1_"Y"#2.3 ; harness Harness P-B1.P1MYA-
P1MYB+: P1_"Y"#2.4 ; harness Harness P-B1.P1MYB+
P1MYB-: P1_"Y"#2.6 ; harness Harness P-B1.P1MYB-
P1XDL: harness Harness P1-XLIMITS.P1XDL
P1XUL: harness Harness P1-XLIMITS.P1XUL
P1YDL: harness Harness P1-YLIMITS.P1YDL
P1YUL: harness Harness P1-YLIMITS.P1YUL
SVE: ?#42.2(+) ?#43.2(K)
X1VE: ?#30.2(K) AIR_VALVES#1.2(+)
X1VR: ?#29.2(+) ?#31.2(K)
X2VE: ?#37.2(K) AIR_VALVES#2.2(+)
X2VR: ?#36.2(+) ?#38.2(K)
Net?#42_10: ?#42.10(-) ?#43.1(A)
NetD?#3_1: D?#3.1(A) R1#1.2

Not connected (* = marked no-connect by the designer): ?#32 1; ?#33 1; ?#34 1; ?#35 1; ?#39 1; ?#40 1; ?#41 1; ?#44 1; ?#45 1

### Notes on the sheet
- 3
- C40 IMB PROBE 1 ACTUATORS
- PROBE 1
- Clippard ET-3M-24 3-Way Electronic Valve 24VDC
- (near P1_"X"#2) TMG 5609L-0502 400 steps/rev NEMA 23 stepper
- WHT
- (near P1_"X"#2) A
- BLK
- (near P1_"X"#2) B
- RD
- BIMBA MRS-021.5-DXP
- (near US_Digital_E2_relative#5) Belden 9504 4-pair 1 shield
- RETRACT LIMIT A
- EXTEND LIMIT A
- UP LIMIT X
- BLACK
- BLU
- BRN
- Pepperl + Fuchs Proximity Sensor NBN4-F29-A0
- BIMBA MR TRACK MOUNTED 4mm round MAGETIC REED SWITCH
- 5 EACH
- DOWN LIMIT X
- MSKX  NPN SINK NO
- NORMALLY OPEN
- LIMIT SWITCH
- (near P1_"Y"#2) TMG 5609L-0502 400 steps/rev NEMA 23 stepper
- (near P1_"Y"#2) A
- BIMBA MRS-022.5-DXP
- (near P1_"Y"#2) B
- (near US_Digital_E2_relative#6) Belden 9504 4-pair 1 shield
- UP LIMIT Y
- DOWN LIMIT Y
- BIMBA 0071
- SHACK-HARTMAN 1
- Labels drawn without touching a wire or pin: 24RET
- Carnegie Institution of Washington
- 813 Santa Barbara Street
- The Observatories
- PHONE (626) 577-1122               FAX (626) 795-8136
- Pasadena, California 91101
- Title:
- OCIW
- Size:
- Date:
- C
- Scale:
- Drawn By:
- Checked By:
- A. BAGISH
- alanb
- Revision:
- Sheet          of
- File:
- (in symbol ENCODER DIF) E

### Library data of the parts
?#29 ?#36 ?#42 AIR_VALVES#1 AIR_VALVES#2 = COIL2
?#30 ?#31 ?#37 ?#38 ?#43 = DIODE(SHORT)
D?#3 = LED0: Typical INFRARED GaAs LED; Manuf #: 607-1212-120F; Published: 8-Jun-2000; LatestRevisionDate: 08-Jul-2005; LatestRevisionNote: Mech Layer 1 removed.; PackageReference: LED-0; Publisher: Altium Limited
IMB_PROBE_1_AIR_CYLINDER_SMALL#1 IMB_PROBE_1_AIR_CYLINDER_X1 IMB_PROBE_1_AIR_CYLINDER_Y2 = AIR CYL LONG IN
P1_"X"#2 P1_"Y"#2 = MOTOR STEPPER
R1#1 = Res3: Resistor; Published: 8-Jun-2000; LatestRevisionDate: 04-Mar-2005; LatestRevisionNote: PCB Footprint replaced.; PackageReference: J1-0603; Publisher: Altium Limited
US_Digital_E2_relative#5 US_Digital_E2_relative#6 = ENCODER DIF

## Sheet PROBE 2 CYLINDERS.SchDoc: PROBE 2 CYLINDERS
size 558 x 401 mm; Organization: Carnegie Institution of Washington; DocumentNumber: 5; SheetNumber: 4; SheetTotal: 7; Engineer: A. BAGISH; PageSetup: Record=PageOptions|CenterHorizontal=True|CenterVertical=True|PrintScale=0.68|XCorrection=1.00|YCorrection=1.00|PrintKind=0|BorderSize=5000000|LeftOffset=0|BottomOffset=0|Orientation=2|PaperLength=1000|PaperWidth=1000|Scale=100|PaperSource=15|PrintQuality=1200|MediaType=1|DitherType=10|PaperKind=11 x 17|PrintScaleMode=1; DocumentName: PROBE 2 CYLINDERS
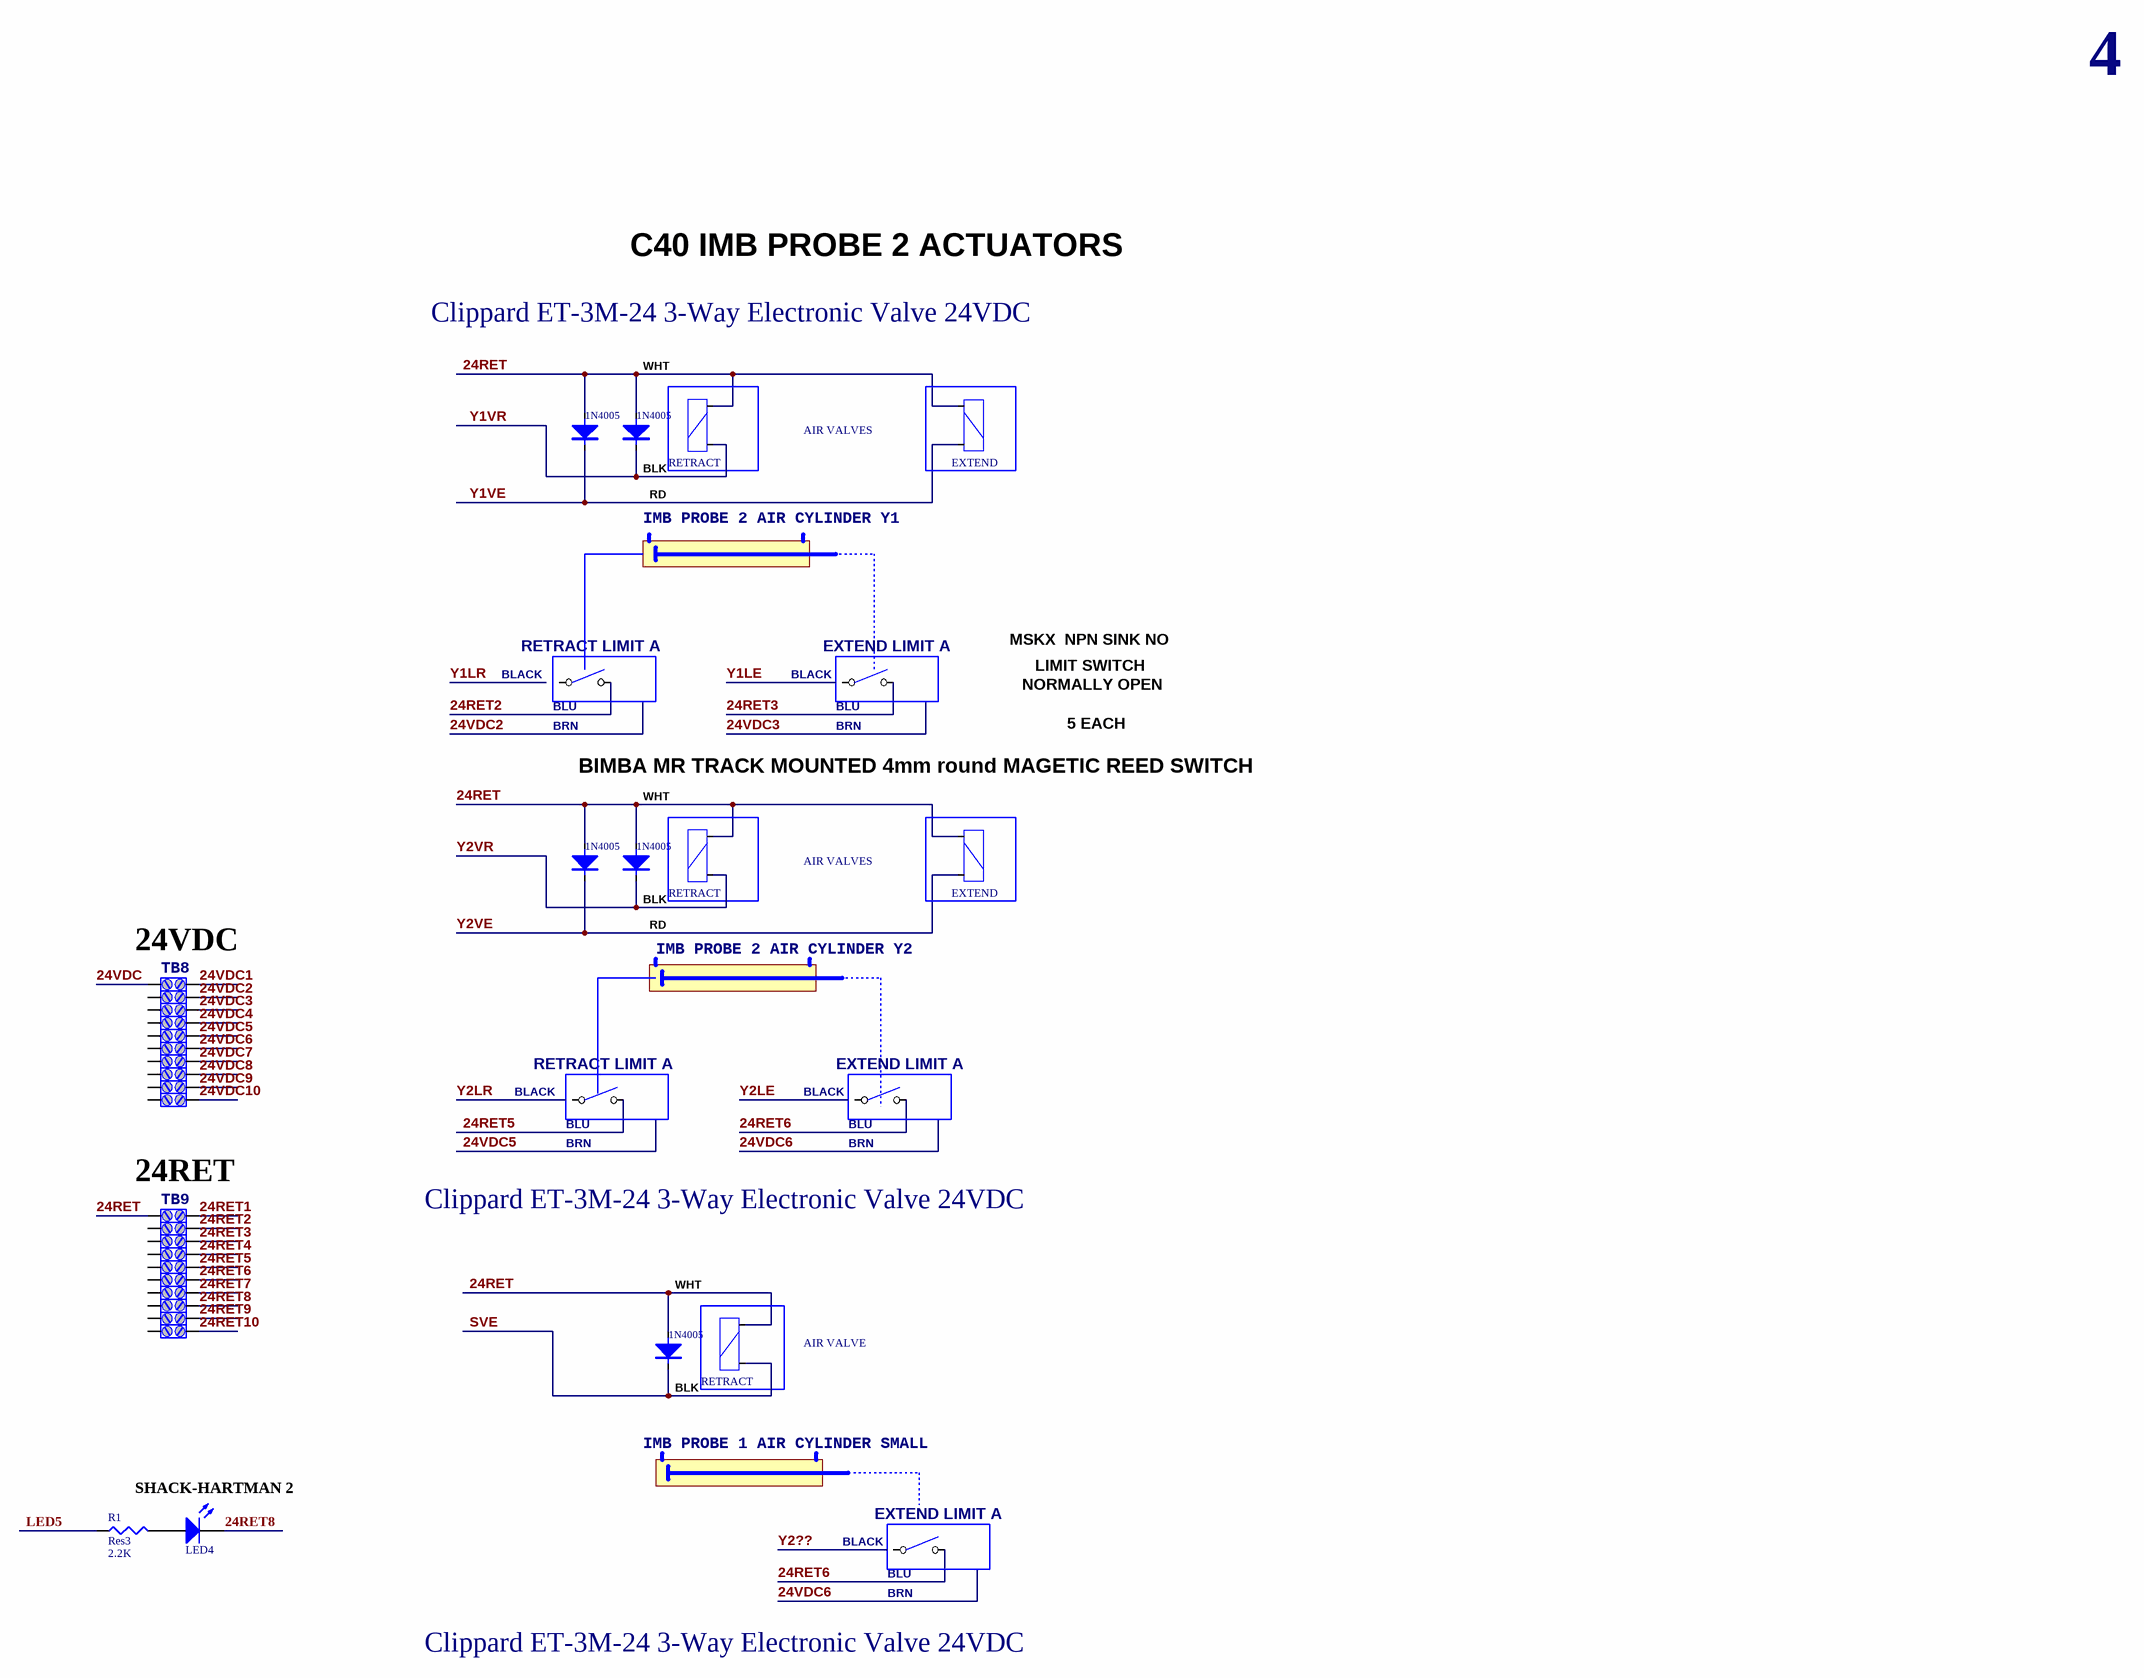
[diagram p12: PROBE 2 CYLINDERS.SchDoc]

### Parts
(Parts that share a designator on the sheet are numbered #1, #2 ... from top to bottom, then left to right.)
?#46  RETRACT
?#47  1N4005
?#48  1N4005
?#49  (no value)
?#50  (no value)
?#51  RETRACT
?#52  1N4005
?#53  1N4005
?#54  (no value)
?#55  (no value)
?#56  (no value)
?#57  (no value)
?#58  (no value)
?#59  (no value)
?#60  (no value)
?#61  (no value)
?#62  (no value)
?#63  (no value)
?#64  (no value)
?#65  (no value)
?#66  (no value)
?#67  (no value)
?#68  (no value)
?#69  (no value)
?#70  (no value)
?#71  (no value)
?#72  (no value)
?#73  (no value)
?#74  RETRACT  S: AIR VALVE
?#75  1N4005
?#76  (no value)
AIR_VALVES#3  EXTEND
AIR_VALVES#4  EXTEND
D?#4  LED4  [LED-0]
IMB_PROBE_1_AIR_CYLINDER_SMALL#2  (no value)
IMB_PROBE_2_AIR_CYLINDER_Y1  (no value)
IMB_PROBE_2_AIR_CYLINDER_Y2  (no value)
R1#2  Res3  value 2.2K  [J1-0603]
TB8#1  (no value)
TB9#1  (no value)

### Nets
24RET: ?#46.10(-) ?#47.1(A) ?#48.1(A) ?#51.10(-) ?#52.1(A) ?#53.1(A) ?#74.10(-) ?#75.1(A) AIR_VALVES#3.10(-) AIR_VALVES#4.10(-) TB9#1.2
24RET1: TB9#1.1
24RET2: ?#49.2 ?#65.1
24RET3: ?#50.2 ?#66.1
24RET4: ?#67.1
24RET5: ?#63.2 ?#68.1
24RET6: ?#64.2 ?#69.1 ?#76.2
24RET7: ?#70.1
24RET8: ?#71.1 D?#4.2(K)
24RET9: ?#72.1
24RET10: ?#73.1
24VDC: TB8#1.2
24VDC1: TB8#1.1
24VDC2: ?#54.1
24VDC3: ?#55.1
24VDC4: ?#56.1
24VDC5: ?#57.1
24VDC6: ?#58.1
24VDC7: ?#59.1
24VDC8: ?#60.1
24VDC9: ?#61.1
24VDC10: ?#62.1
LED5: R1#2.1
SVE: ?#74.2(+) ?#75.2(K)
Y1VE: ?#47.2(K) AIR_VALVES#3.2(+)
Y1VR: ?#46.2(+) ?#48.2(K)
Y2VE: ?#52.2(K) AIR_VALVES#4.2(+)
Y2VR: ?#51.2(+) ?#53.2(K)
NetD?#4_1: D?#4.1(A) R1#2.2

Not connected (* = marked no-connect by the designer): ?#49 1; ?#50 1; ?#54 2; ?#55 2; ?#56 2; ?#57 2; ?#58 2; ?#59 2; ?#60 2; ?#61 2; ?#62 2; ?#63 1; ?#64 1; ?#65 2; ?#66 2; ?#67 2; ?#68 2; ?#69 2; ?#70 2; ?#71 2; ?#72 2; ?#73 2; ?#76 1

### Notes on the sheet
- 4
- C40 IMB PROBE 2 ACTUATORS
- Clippard ET-3M-24 3-Way Electronic Valve 24VDC
- WHT
- BLK
- RD
- BLACK
- RETRACT LIMIT A
- EXTEND LIMIT A
- MSKX  NPN SINK NO
- LIMIT SWITCH
- BLU
- BRN
- NORMALLY OPEN
- 5 EACH
- BIMBA MR TRACK MOUNTED 4mm round MAGETIC REED SWITCH
- (near TB8#1) 24VDC
- (near TB9#1) 24RET
- SHACK-HARTMAN 2
- Carnegie Institution of Washington
- 813 Santa Barbara Street
- The Observatories
- PHONE (626) 577-1122               FAX (626) 795-8136
- Pasadena, California 91101
- Title:
- OCIW
- Size:
- Date:
- C
- Scale:
- Drawn By:
- Checked By:
- A. BAGISH
- alanb
- Revision:
- Sheet          of
- File:

### Library data of the parts
?#46 ?#51 ?#74 AIR_VALVES#3 AIR_VALVES#4 = COIL2
?#47 ?#48 ?#52 ?#53 ?#75 = DIODE(SHORT)
?#49 ?#50 ?#63 ?#64 ?#76 = SW-SPST
?#54 ?#65 = TB3: Part Field 1: 23; Part Field 2: 24
?#55 ?#66 = TB3: Part Field 1: 25; Part Field 2: 26
?#56 ?#67 = TB3: Part Field 1: 27; Part Field 2: 28
?#57 ?#68 = TB3: Part Field 1: 29; Part Field 2: 30
?#58 ?#69 = TB3: Part Field 1: 31; Part Field 2: 32
?#59 ?#70 = TB3: Part Field 1: 33; Part Field 2: 34
?#60 ?#71 = TB3: Part Field 1: 35; Part Field 2: 36
?#61 ?#72 = TB3: Part Field 1: 37; Part Field 2: 38
?#62 ?#73 = TB3: Part Field 1: 39; Part Field 2: 40
D?#4 = LED0: as D?#3 on sheet PROBE 1 CYLINDERS; Published: 8-Jun-2000; LatestRevisionDate: 08-Jul-2005; LatestRevisionNote: Mech Layer 1 removed.; PackageReference: LED-0; Publisher: Altium Limited
IMB_PROBE_1_AIR_CYLINDER_SMALL#2 IMB_PROBE_2_AIR_CYLINDER_Y1 IMB_PROBE_2_AIR_CYLINDER_Y2 = AIR CYL LONG IN
R1#2 = Res3: Resistor; Published: 8-Jun-2000; LatestRevisionDate: 04-Mar-2005; LatestRevisionNote: PCB Footprint replaced.; PackageReference: J1-0603; Publisher: Altium Limited
TB8#1 TB9#1 = TB3: Part Field 1: 21; Part Field 2: 22

## Sheet MOTORS ENCODERS.SchDoc: MOTORS & ENCODERS
size 558 x 401 mm; Organization: Carnegie Institution of Washington; DocumentNumber: 6; SheetNumber: 5; SheetTotal: 7; PageSetup: Record=PageOptions|CenterHorizontal=True|CenterVertical=True|PrintScale=0.47|XCorrection=1.00|YCorrection=1.00|PrintKind=0|BorderSize=5000000|LeftOffset=0|BottomOffset=0|Orientation=2|PaperLength=1000|PaperWidth=1000|Scale=100|PaperSource=259|PrintQuality=600|MediaType=1|DitherType=10|PaperKind=11 x 17|PrintScaleMode=1
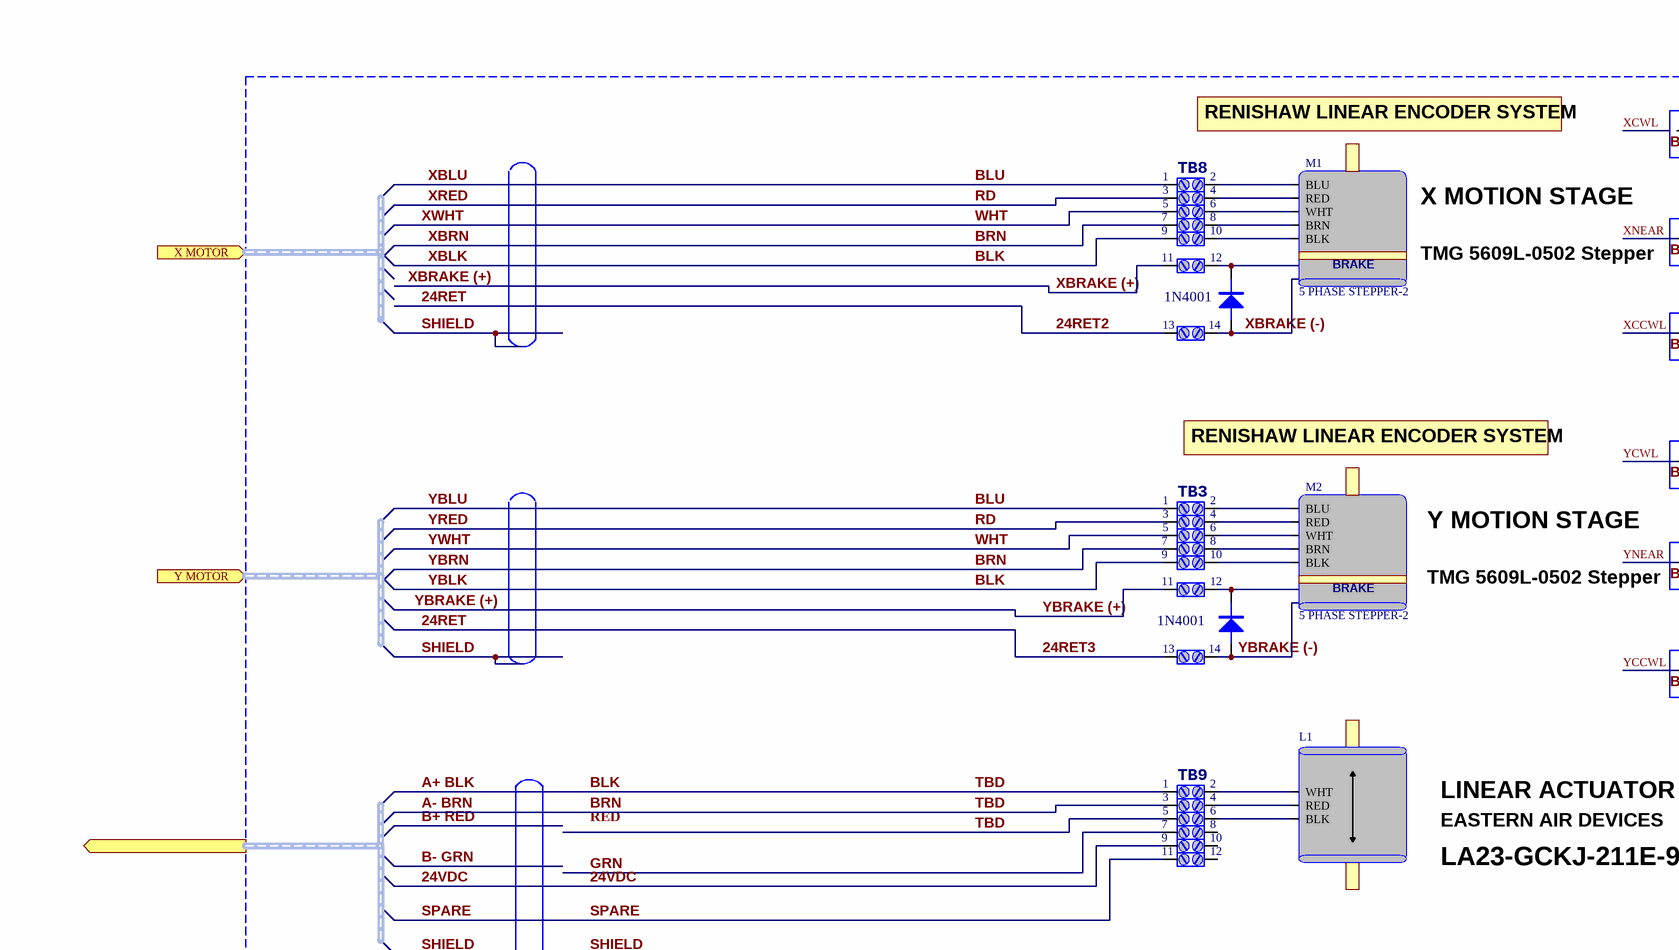
[diagram p13: MOTORS ENCODERS.SchDoc, top left]
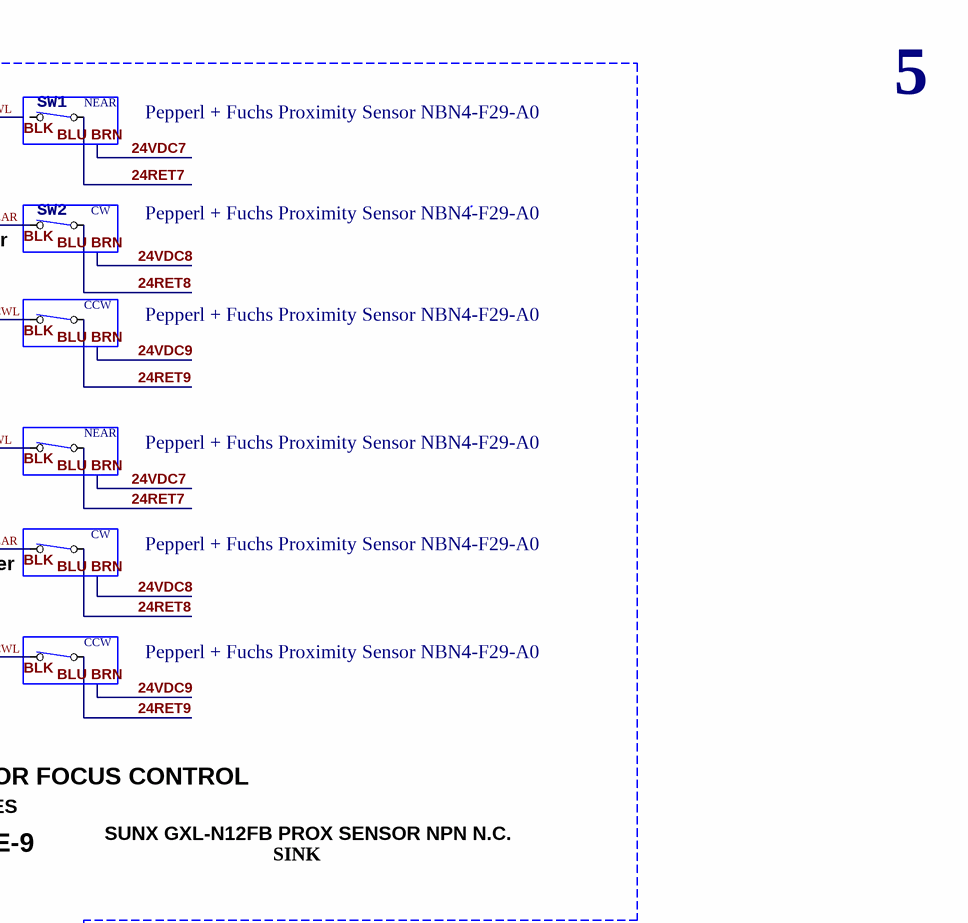
[diagram p14: MOTORS ENCODERS.SchDoc, top right]
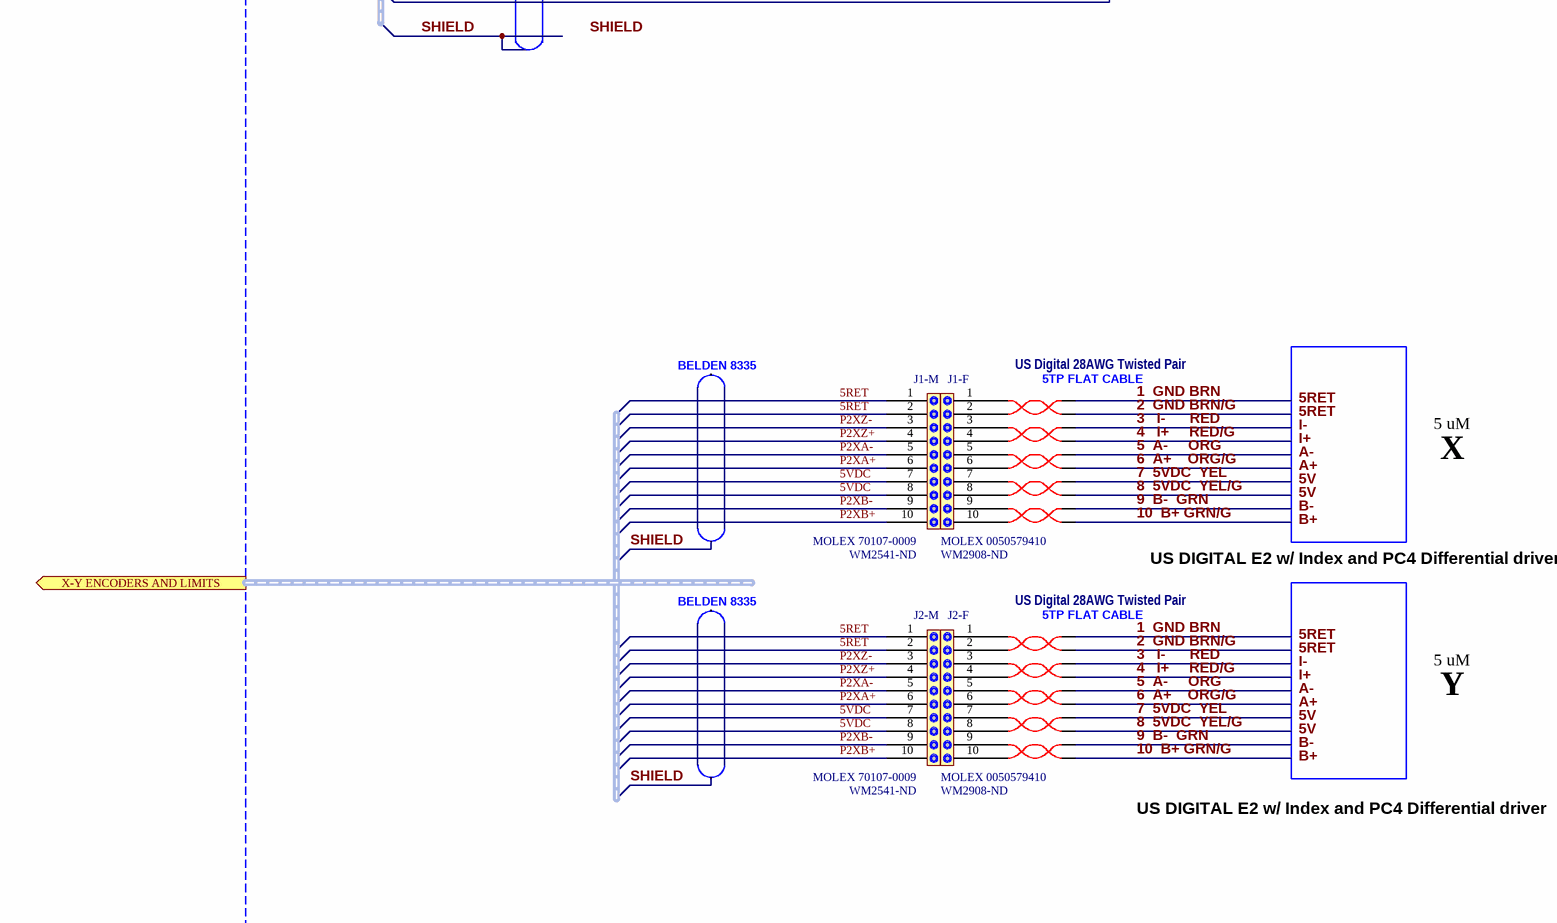
[diagram p15: MOTORS ENCODERS.SchDoc, bottom left]

### Parts
(Parts that share a designator on the sheet are numbered #1, #2 ... from top to bottom, then left to right.)
?#77  Part Field 1: 3  Part Field 2: 4
?#78  Part Field 1: 5  Part Field 2: 6
?#79  Part Field 1: 7  Part Field 2: 8
?#80  Part Field 1: 9  Part Field 2: 10
?#81  Part Field 1: 11  Part Field 2: 12
?#82  (no value)
?#83  Part Field 1: 13  Part Field 2: 14
?#84  (no value)
?#85  (no value)
?#86  Part Field 1: 3  Part Field 2: 4
?#87  Part Field 1: 5  Part Field 2: 6
?#88  Part Field 1: 7  Part Field 2: 8
?#89  Part Field 1: 9  Part Field 2: 10
?#90  (no value)
?#91  Part Field 1: 11  Part Field 2: 12
?#92  (no value)
?#93  Part Field 1: 13  Part Field 2: 14
?#94  (no value)
?#95  Part Field 1: 3  Part Field 2: 4
?#96  Part Field 1: 5  Part Field 2: 6
?#97  Part Field 1: 7  Part Field 2: 8
?#98  Part Field 1: 9  Part Field 2: 10
?#99  Part Field 1: 11  Part Field 2: 12
?#100  (no value)
?#101  TP1  (value not drawn)
?#102  TP1  (value not drawn)
?#103  TP1  (value not drawn)
?#104  TP1  (value not drawn)
?#105  TP1  (value not drawn)
?#106  (no value)
?#107  (no value)
?#108  TP1  (value not drawn)
?#109  TP1  (value not drawn)
?#110  TP1  (value not drawn)
?#111  TP1  (value not drawn)
?#112  TP1  (value not drawn)
?#113  (no value)
J1-F  MOLEX 0050579410  Digikey: WM2908-ND
J1-M  MOLEX 70107-0009  Digikey: WM2541-ND
J2-F  MOLEX 0050579410  Digikey: WM2908-ND
J2-M  MOLEX 70107-0009  Digikey: WM2541-ND
L1  LINEAR MOTOR  (value not drawn)
M1  5 PHASE STEPPER-2
M2  5 PHASE STEPPER-2
SW1  (no value)
SW2#1  (no value)
TB3  Part Field 1: 1  Part Field 2: 2
TB8#2  Part Field 1: 1  Part Field 2: 2
TB9#2  Part Field 1: 1  Part Field 2: 2

### Blocks framed on the sheet
NEAR: SW1
CW: SW2#1
CCW: ?#84
NEAR: ?#85
CW: ?#90
CCW: ?#94

### Ports
X MOTOR, X-Y ENCODERS AND LIMITS, Y MOTOR, 

### Nets
1  GND BRN: ?#101.18 ?#108.18
2  GND BRN/G: ?#101.17 ?#108.17
3   I-      RED: ?#102.18 ?#109.18
4   I+     RED/G: ?#102.17 ?#109.17
5  A-     ORG: ?#103.18 ?#110.18
5RET: J1-M.1 J1-M.2 J2-M.1 J2-M.2
5VDC: J1-M.7 J1-M.8 J2-M.7 J2-M.8
6  A+    ORG/G: ?#103.17 ?#110.17
7  5VDC  YEL : ?#104.18 ?#111.18
8  5VDC  YEL/G : ?#104.17 ?#111.17
9  B-  GRN: ?#105.18 ?#112.18
10  B+ GRN/G: ?#105.17 ?#112.17
24RET: ?#83.2 ?#93.2  [also labelled 24RET2, 24RET3]
24RET7: ?#85.1 SW1.1
24RET8: ?#90.1 SW2#1.1
24RET9: ?#84.1 ?#94.1
24VDC: ?#98.2
A+ BLK: ?#79.2 ?#80.2 ?#88.2 ?#89.2 ?#95.2 ?#96.2 TB9#2.2  [also labelled A- BRN, BLK, BRN, TBD, XBLK, XBRN, YBLK, YBRN]
BLU: TB3.2 TB8#2.2  [also labelled XBLU, YBLU]
GRN: ?#97.2
P2XA+: J1-M.6 J2-M.6
P2XA-: J1-M.5 J2-M.5
P2XB+: J1-M.10 J2-M.10
P2XB-: J1-M.9 J2-M.9
P2XZ+: J1-M.4 J2-M.4
P2XZ-: J1-M.3 J2-M.3
RD: ?#77.2 ?#86.2  [also labelled XRED, YRED]
SHIELD: ?#106.29(SENCE_HI) ?#113.29(SENCE_HI)
SPARE: ?#99.2
WHT: ?#78.2 ?#87.2  [also labelled XWHT, YWHT]
XBRAKE (+): ?#81.2
XBRAKE (-): ?#82.A ?#83.1
XCCWL: ?#84.2
XNEAR: SW2#1.2
YBRAKE (+): ?#91.2
YBRAKE (-): ?#92.A ?#93.1
YCCWL: ?#94.2
YCWL: ?#85.2
YNEAR: ?#90.2
Net?#77_1: ?#77.1 M1.?2(RED)
Net?#78_1: ?#78.1 M1.?3(WHT)
Net?#79_1: ?#79.1 M1.?4(BRN)
Net?#80_1: ?#80.1 M1.?5(BLK)
Net?#81_1: ?#81.1 ?#82.K
Net?#86_1: ?#86.1 M2.?2(RED)
Net?#87_1: ?#87.1 M2.?3(WHT)
Net?#88_1: ?#88.1 M2.?4(BRN)
Net?#89_1: ?#89.1 M2.?5(BLK)
Net?#91_1: ?#91.1 ?#92.K
Net?#95_1: ?#95.1 L1.?1(RED)
Net?#96_1: ?#96.1 L1.?3(BLK)
Net?#101_15: ?#101.15 J1-F.1
Net?#101_16: ?#101.16 J1-F.2
Net?#102_15: ?#102.15 J1-F.3
Net?#102_16: ?#102.16 J1-F.4
Net?#103_15: ?#103.15 J1-F.5
Net?#103_16: ?#103.16 J1-F.6
Net?#104_15: ?#104.15 J1-F.7
Net?#104_16: ?#104.16 J1-F.8
Net?#105_15: ?#105.15 J1-F.9
Net?#105_16: ?#105.16 J1-F.10
Net?#108_15: ?#108.15 J2-F.1
Net?#108_16: ?#108.16 J2-F.2
Net?#109_15: ?#109.15 J2-F.3
Net?#109_16: ?#109.16 J2-F.4
Net?#110_15: ?#110.15 J2-F.5
Net?#110_16: ?#110.16 J2-F.6
Net?#111_15: ?#111.15 J2-F.7
Net?#111_16: ?#111.16 J2-F.8
Net?#112_15: ?#112.15 J2-F.9
Net?#112_16: ?#112.16 J2-F.10
NetL1_?2: L1.?2(WHT) TB9#2.1
NetM1_?1: M1.?1(BLU) TB8#2.1
NetM2_?1: M2.?1(BLU) TB3.1

Not connected (* = marked no-connect by the designer): ?#97 1; ?#98 1; ?#99 1; ?#100 29(SENCE_HI); ?#107 29(SENCE_HI); SW1 2

### Notes on the sheet
- RENISHAW LINEAR ENCODER SYSTEM
- Pepperl + Fuchs Proximity Sensor NBN4-F29-A0
- 5
- (near M1) BRAKE
- TMG 5609L-0502 Stepper
- X MOTION STAGE
- 1N4001
- Y MOTION STAGE
- (near M2) BRAKE
- LINEAR ACTUATOR FOCUS CONTROL
- LA23-GCKJ-211E-9
- EASTERN AIR DEVICES
- SUNX GXL-N12FB PROX SENSOR NPN N.C.
- SINK
- BELDEN 8335
- US Digital 28AWG Twisted Pair
- 5TP FLAT CABLE
- 5 uM
- X
- US DIGITAL E2 w/ Index and PC4 Differential driver
- Y
- Labels drawn without touching a wire or pin: 5RET, 5V, A+, A-, B+, B-, BLK, BLU, BRN, I+, I-, RED, SHIELD
- Carnegie Institution of Washington
- 813 Santa Barbara Street
- The Observatories
- PHONE (626) 577-1122               FAX (626) 795-8136
- Pasadena, California 91101
- Title:
- OCIW
- Size:
- Date:
- C
- Scale:
- Drawn By:
- Checked By:
- A. BAGISH
- alanb
- Revision:
- Sheet          of
- File:

### Library data of the parts
?#77-?#81 ?#83 ?#86-?#89 ?#91 ?#93 ?#95-?#99 TB3 TB8#2 TB9#2 = TB3
?#82 ?#92 = DIODE
?#84 ?#85 ?#90 ?#94 SW1 SW2#1 = SW-NC2
?#100 ?#106 ?#107 ?#113 = ARC
J1-F J1-M J2-F J2-M = TP10

## Sheet C40 IMB POWER SUPPLY.SchDoc: C40 IMB POWER SUPPLY
size B; Organization: Carnegie Institution of Washington; DocumentNumber: 7; SheetNumber: 6; SheetTotal: 7; PageSetup: Record=PageOptions|CenterHorizontal=True|CenterVertical=True|PrintScale=1.12|XCorrection=1.00|YCorrection=1.00|PrintKind=0|BorderSize=5000000|LeftOffset=0|BottomOffset=0|Orientation=2|PaperLength=1000|PaperWidth=1000|Scale=100|PaperSource=15|PrintQuality=1200|MediaType=1|DitherType=10|PaperKind=11 x 17|PrintScaleMode=1
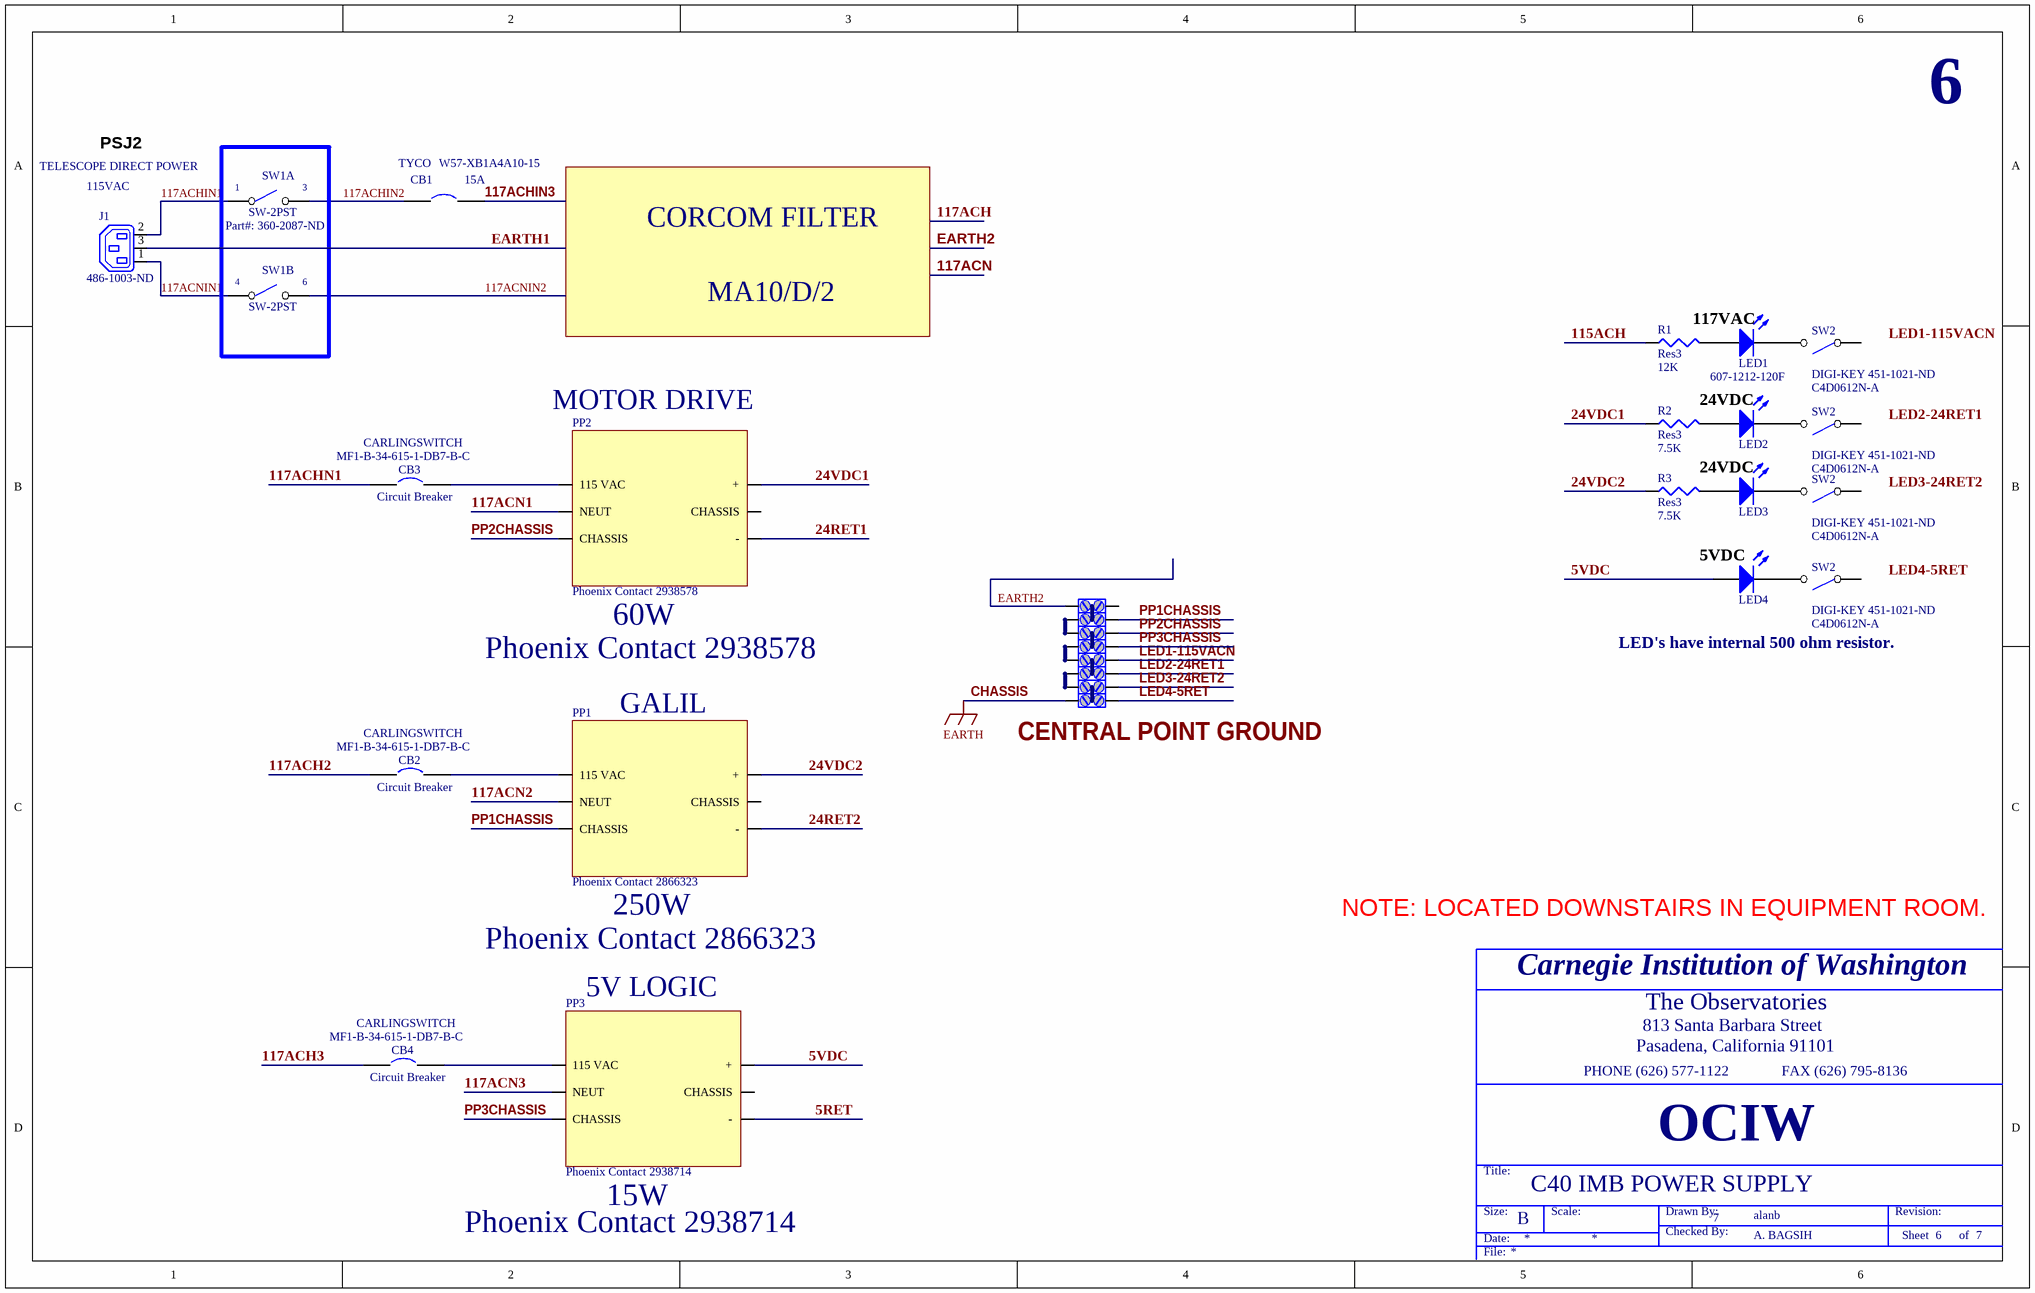
[diagram p16: C40 IMB POWER SUPPLY.SchDoc]

### Parts
(Parts that share a designator on the sheet are numbered #1, #2 ... from top to bottom, then left to right.)
?#114  (no value)
?#115  (no value)
?#116  (no value)
?#117  (no value)
?#118  (no value)
?#119  (no value)
?#120  (no value)
?#121  (no value)
CB1  15A
CB2  Circuit Breaker  Manufacturer: CARLINGSWITCH  PART#: MF1-B-34-615-1-DB7-B-C  [SPST-2]
CB3  Circuit Breaker  Manufacturer: CARLINGSWITCH  PART#: MF1-B-34-615-1-DB7-B-C  [SPST-2]
CB4  Circuit Breaker  Manufacturer: CARLINGSWITCH  PART#: MF1-B-34-615-1-DB7-B-C  [SPST-2]
D?#5  LED1  Manuf #: 607-1212-120F  [LED-0]
D?#6  LED2  [LED-0]
D?#7  LED3  [LED-0]
D?#8  LED4  [LED-0]
J1  115VAC  PART #: 486-1003-ND  [IEC7-2H3]
PP1  Phoenix Contact 2866323
PP2  Phoenix Contact 2938578
PP3  Phoenix Contact 2938714
R1#3  Res3  value 12K  [J1-0603]
R2  Res3  value 7.5K  [J1-0603]
R3  Res3  value 7.5K  [J1-0603]
SW1A  SW-2PST  Part#: 360-2087-ND
SW1B  SW-2PST
SW2#2  Part #: DIGI-KEY 451-1021-ND  Electroswitch: C4D0612N-A
SW2#3  Part #: DIGI-KEY 451-1021-ND  Electroswitch: C4D0612N-A
SW2#4  Part #: DIGI-KEY 451-1021-ND  Electroswitch: C4D0612N-A
SW2#5  Part #: DIGI-KEY 451-1021-ND  Electroswitch: C4D0612N-A

### Nets
CHASSIS: ?#121.1  [also labelled EARTH]
5RET: PP3.24(-)
5VDC: D?#8.1(A) PP3.25(+)
24RET1: PP2.24(-)
24RET2: PP1.24(-)
24VDC1: PP2.25(+) R2.1
24VDC2: PP1.25(+) R3.1
115ACH: R1#3.1
117ACH2: CB2.1
117ACH3: CB4.1
117ACHIN1: J1.2(N) SW1A.1
117ACHIN2: CB1.1 SW1A.2
117ACHIN3: CB1.2
117ACHN1: CB3.1
117ACN1: PP2.22(NEUT)
117ACN2: PP1.22(NEUT)
117ACN3: PP3.22(NEUT)
117ACNIN1: J1.1(L) SW1B.1
117ACNIN2: SW1B.2
EARTH1: J1.3(E)
EARTH2: ?#114.1
LED1-115VACN: ?#118.2
LED2-24RET1: ?#119.2
LED3-24RET2: ?#120.2
LED4-5RET: ?#121.2
PP1CHASSIS: ?#115.2 PP1.23(CHASSIS)
PP2CHASSIS: ?#116.2 PP2.23(CHASSIS)
PP3CHASSIS: ?#117.2 PP3.23(CHASSIS)
Net?#115_1: ?#115.1 ?#116.1
Net?#117_1: ?#117.1 ?#118.1
Net?#119_1: ?#119.1 ?#120.1
NetCB2_2: CB2.2 PP1.21(115_VAC)
NetCB3_2: CB3.2 PP2.21(115_VAC)
NetCB4_2: CB4.2 PP3.21(115_VAC)
NetD?#5_1: D?#5.1(A) R1#3.2
NetD?#5_2: D?#5.2(K) SW2#2.2
NetD?#6_1: D?#6.1(A) R2.2
NetD?#6_2: D?#6.2(K) SW2#3.2
NetD?#7_1: D?#7.1(A) R3.2
NetD?#7_2: D?#7.2(K) SW2#4.2
NetD?#8_2: D?#8.2(K) SW2#5.2

Not connected (* = marked no-connect by the designer): ?#114 2; PP1 ?1(CHASSIS); PP2 ?1(CHASSIS); PP3 ?1(CHASSIS); SW2#2 1; SW2#3 1; SW2#4 1; SW2#5 1

### Notes on the sheet
- PSJ2
- 6
- TELESCOPE DIRECT POWER
- (near SW1A) 1
- (near SW1A) 3
- CORCOM FILTER
- (near SW1B) 4
- (near SW1B) 6
- MA10/D/2
- 117VAC
- MOTOR DRIVE
- 24VDC
- (near D?#8) 5VDC
- 60W
- Phoenix Contact 2938578
- LED's have internal 500 ohm resistor.
- GALIL
- Phoenix Contact 2866323
- 250W
- NOTE: LOCATED DOWNSTAIRS IN EQUIPMENT ROOM.
- 5V LOGIC
- Phoenix Contact 2938714
- 15W
- Labels drawn without touching a wire or pin: CENTRAL POINT GROUND, LED1-115VACN, LED2-24RET1, LED3-24RET2, LED4-5RET
- Carnegie Institution of Washington
- 813 Santa Barbara Street
- The Observatories
- PHONE (626) 577-1122               FAX (626) 795-8136
- Pasadena, California 91101
- Title:
- OCIW
- Size:
- Date:
- B
- Scale:
- Drawn By:
- Checked By:
- A. BAGSIH
- alanb
- Revision:
- Sheet          of
- File:
- (in symbol CIRCUIT BREAKER) TYCO; W57-XB1A4A10-15

### Library data of the parts
?#114-?#121 = TB3
CB1 = CIRCUIT BREAKER: Newark Part Number:  98K3355  TYCO ELECTRONICS / POTTER & BRUMFIELD - W57-XB1A4A10-15 - CIRCUIT BREAKER, THERMAL, 1P, 250V, 15A
D?#5 = LED0: Typical INFRARED GaAs LED; Published: 8-Jun-2000; LatestRevisionDate: 08-Jul-2005; LatestRevisionNote: Mech Layer 1 removed.; PackageReference: LED-0; Publisher: Altium Limited
D?#6-D?#8 = LED0: as D?#3 on sheet PROBE 1 CYLINDERS; Published: 8-Jun-2000; LatestRevisionDate: 08-Jul-2005; LatestRevisionNote: Mech Layer 1 removed.; PackageReference: LED-0; Publisher: Altium Limited
J1 = Plug AC Female: IEC Mains Power Outlet, EN60 320-2-2 F Class I, PC Flange Rear Mount, Chassis Socket; PackageDocument: ver.80, 15-Sep-2003; MaximumRating: 10A, 250V a.c. (UL & CSA 15A, 250V a.c.); MountingFixtures: Not drawn on schematic symbol.; PCB_Layout: Complies with manufacturer's recommendation.; DrillSize: Corresponds to nominal value.; Published: 15-Jul-2004; LatestRevisionDate: 15-Jul-2004; LatestRevisionNote: Component Replaced & renamed from "Phonejack".; DatasheetDocument: ver.80, 15-Sep-2003; PackageReference: PX0675/PC; Publisher: Altium Limited; Terminations: P.C. Spills; ComponentLink1Description: Manufacturer Link; ComponentLink1URL: http://www.bulgin.co.uk/
PP1-PP3 = Power Supply 1
R1#3 R2 R3 = Res3: Resistor; Published: 8-Jun-2000; LatestRevisionDate: 04-Mar-2005; LatestRevisionNote: PCB Footprint replaced.; PackageReference: J1-0603; Publisher: Altium Limited
SW1A SW1B = SW-SPST: Digi-Key Part Number 360-2087-ND   SWITCH TOGGLE DPST 25A
SW2#2-SW2#5 = SW-SPST
CB2-CB4 = Circuit Breaker: Published: 24-Mar-1999; LatestRevisionDate: 17-Jul-2002; LatestRevisionNote: Re-released for DXP Platform.; PackageReference: SPST-2; Publisher: Altium Limited